# EasyEDA Pro project 4G-watch-pcb.epro

# Schematic Schematic1_1

## Sheets
1 MIC_SPK: Assembly Variant: Basic; Board Name: Board1; Create Date: 2026-01-22; Page Name: P5; Project Name: 手表; Schematic Name: Schematic1; Update Date: 2026-01-22; BladeWidth: 10; Company: 嘉立创EDA; Page Size: A4; RegionStart: 1; ShowBorder: 1; TitleBlock: 1; TitleBlockPosition: 3; Version: V1.0; XRegionCount: 6; YRegionCount: 4
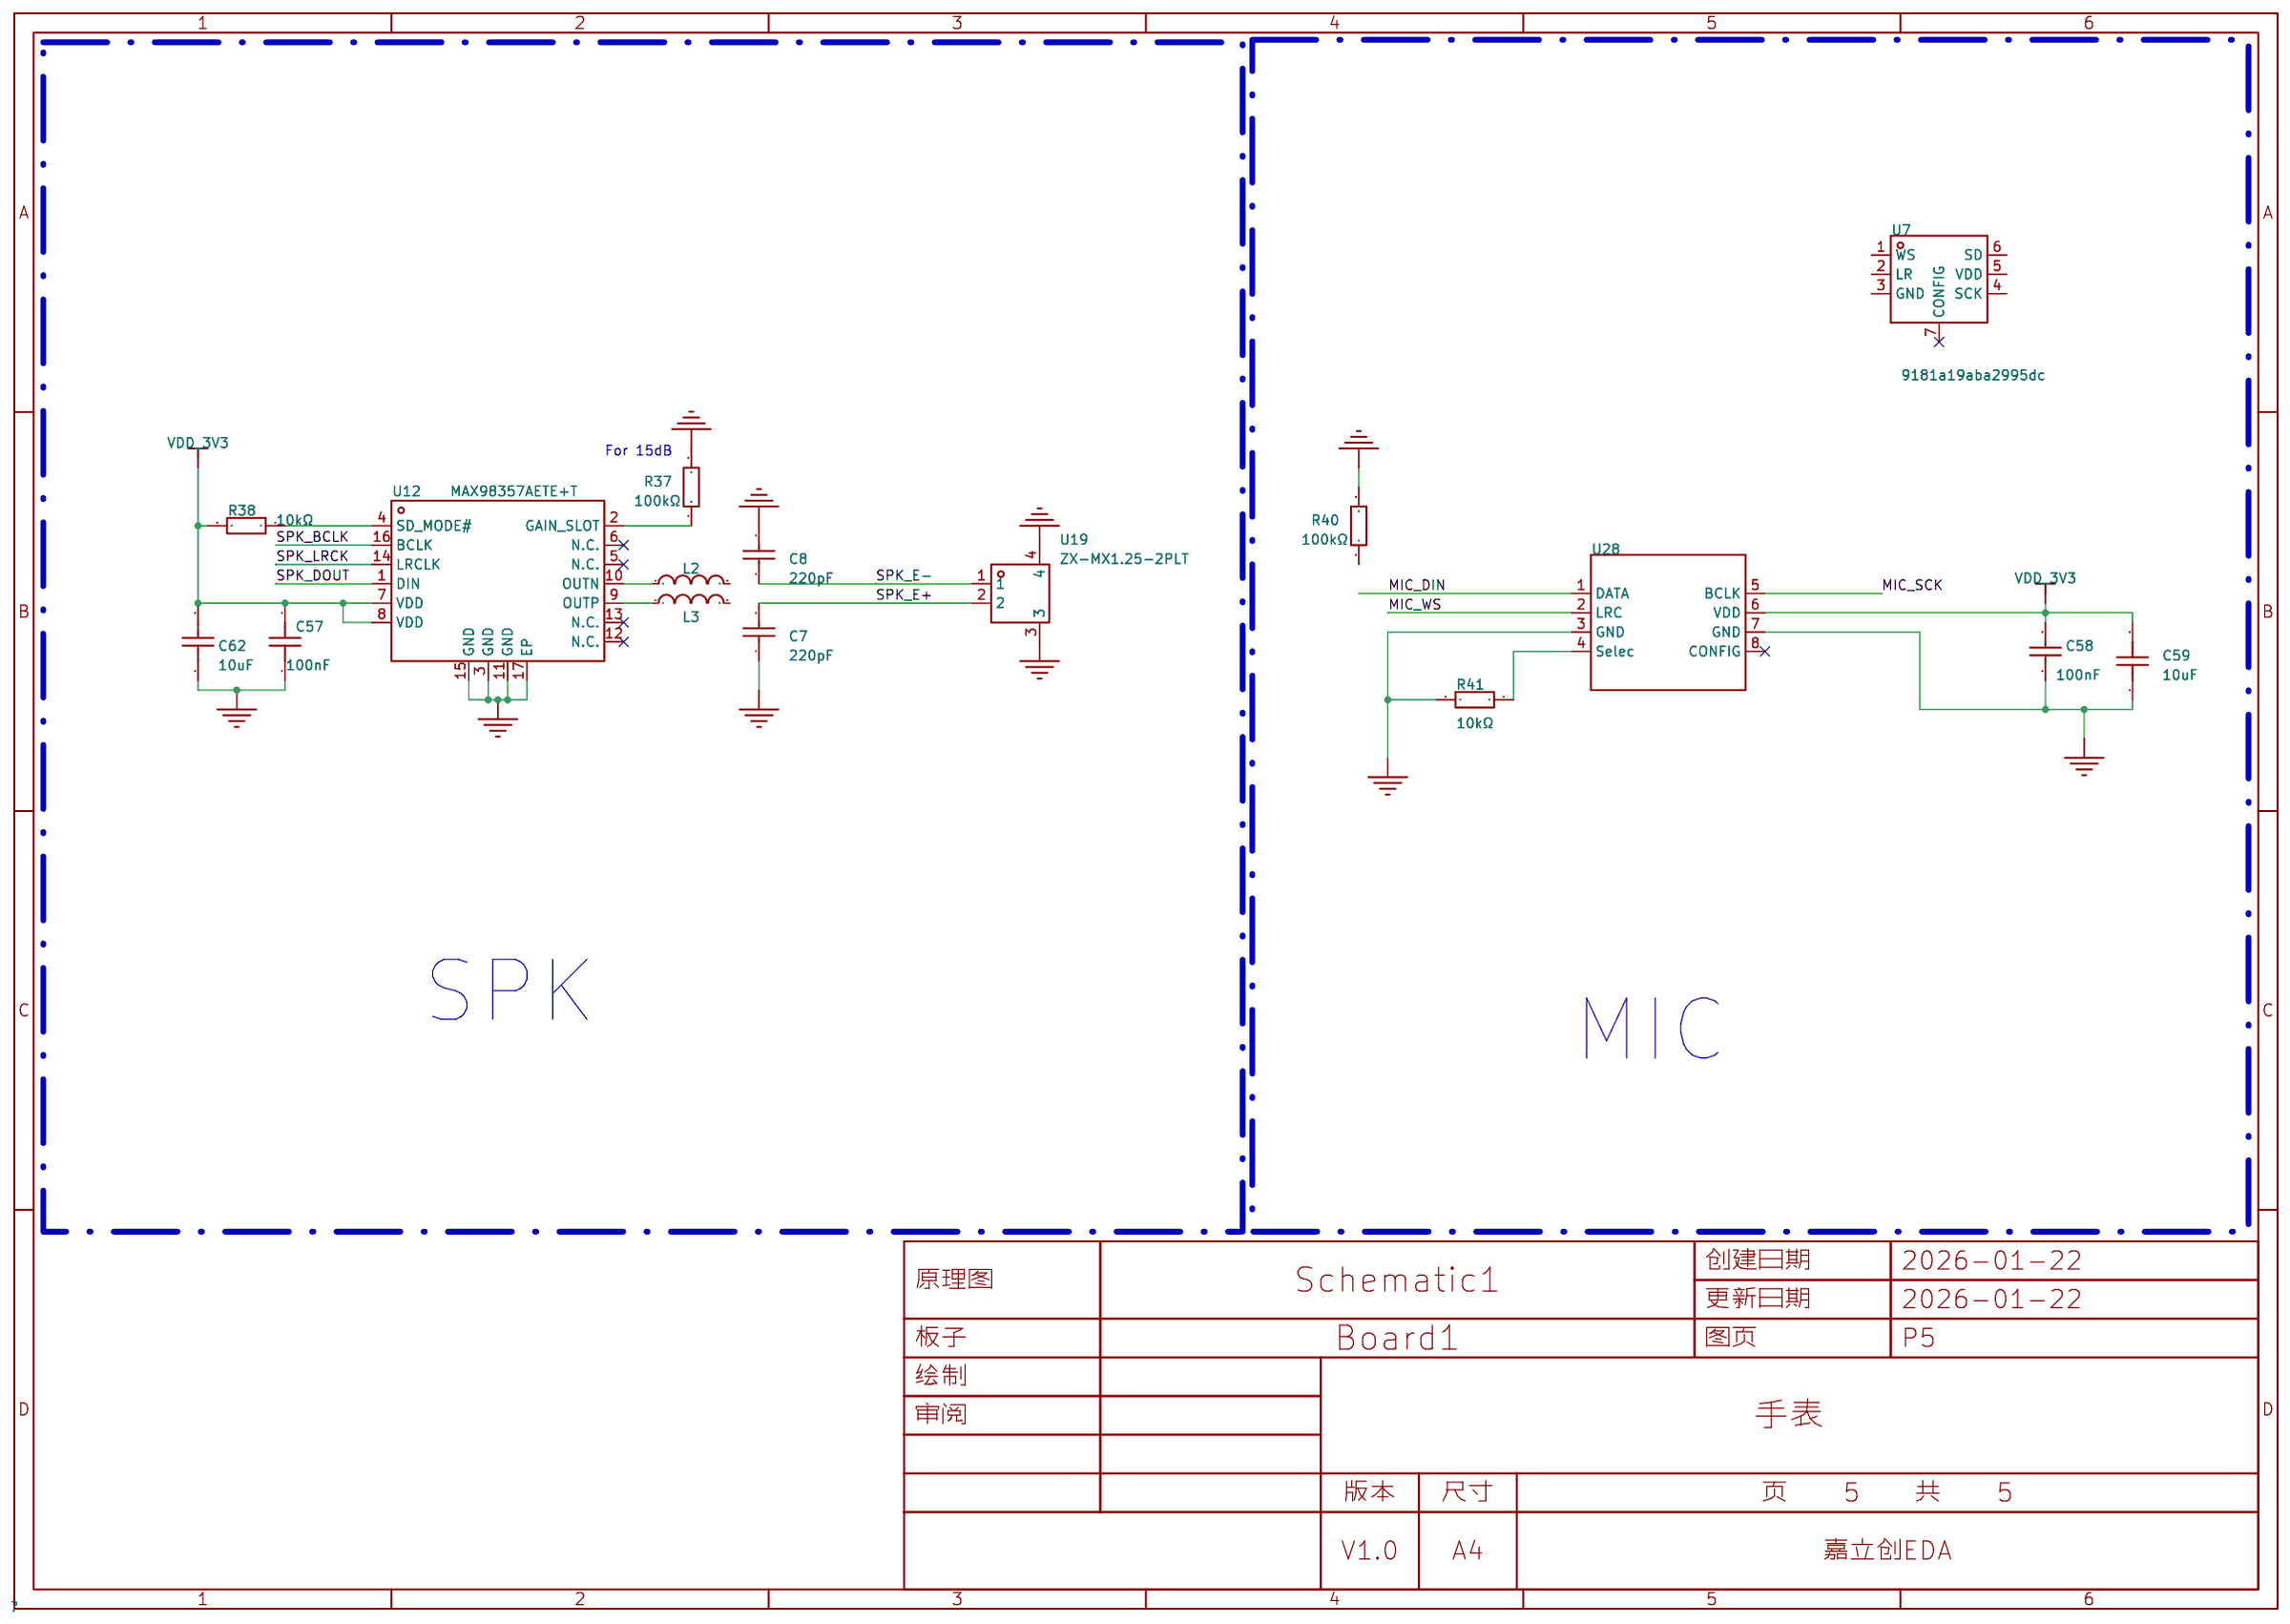
[diagram p0: MIC_SPK]
2 ESP32S3R8: Create Date: 2026-01-21; Page Name: P3; Update Date: 2026-01-21
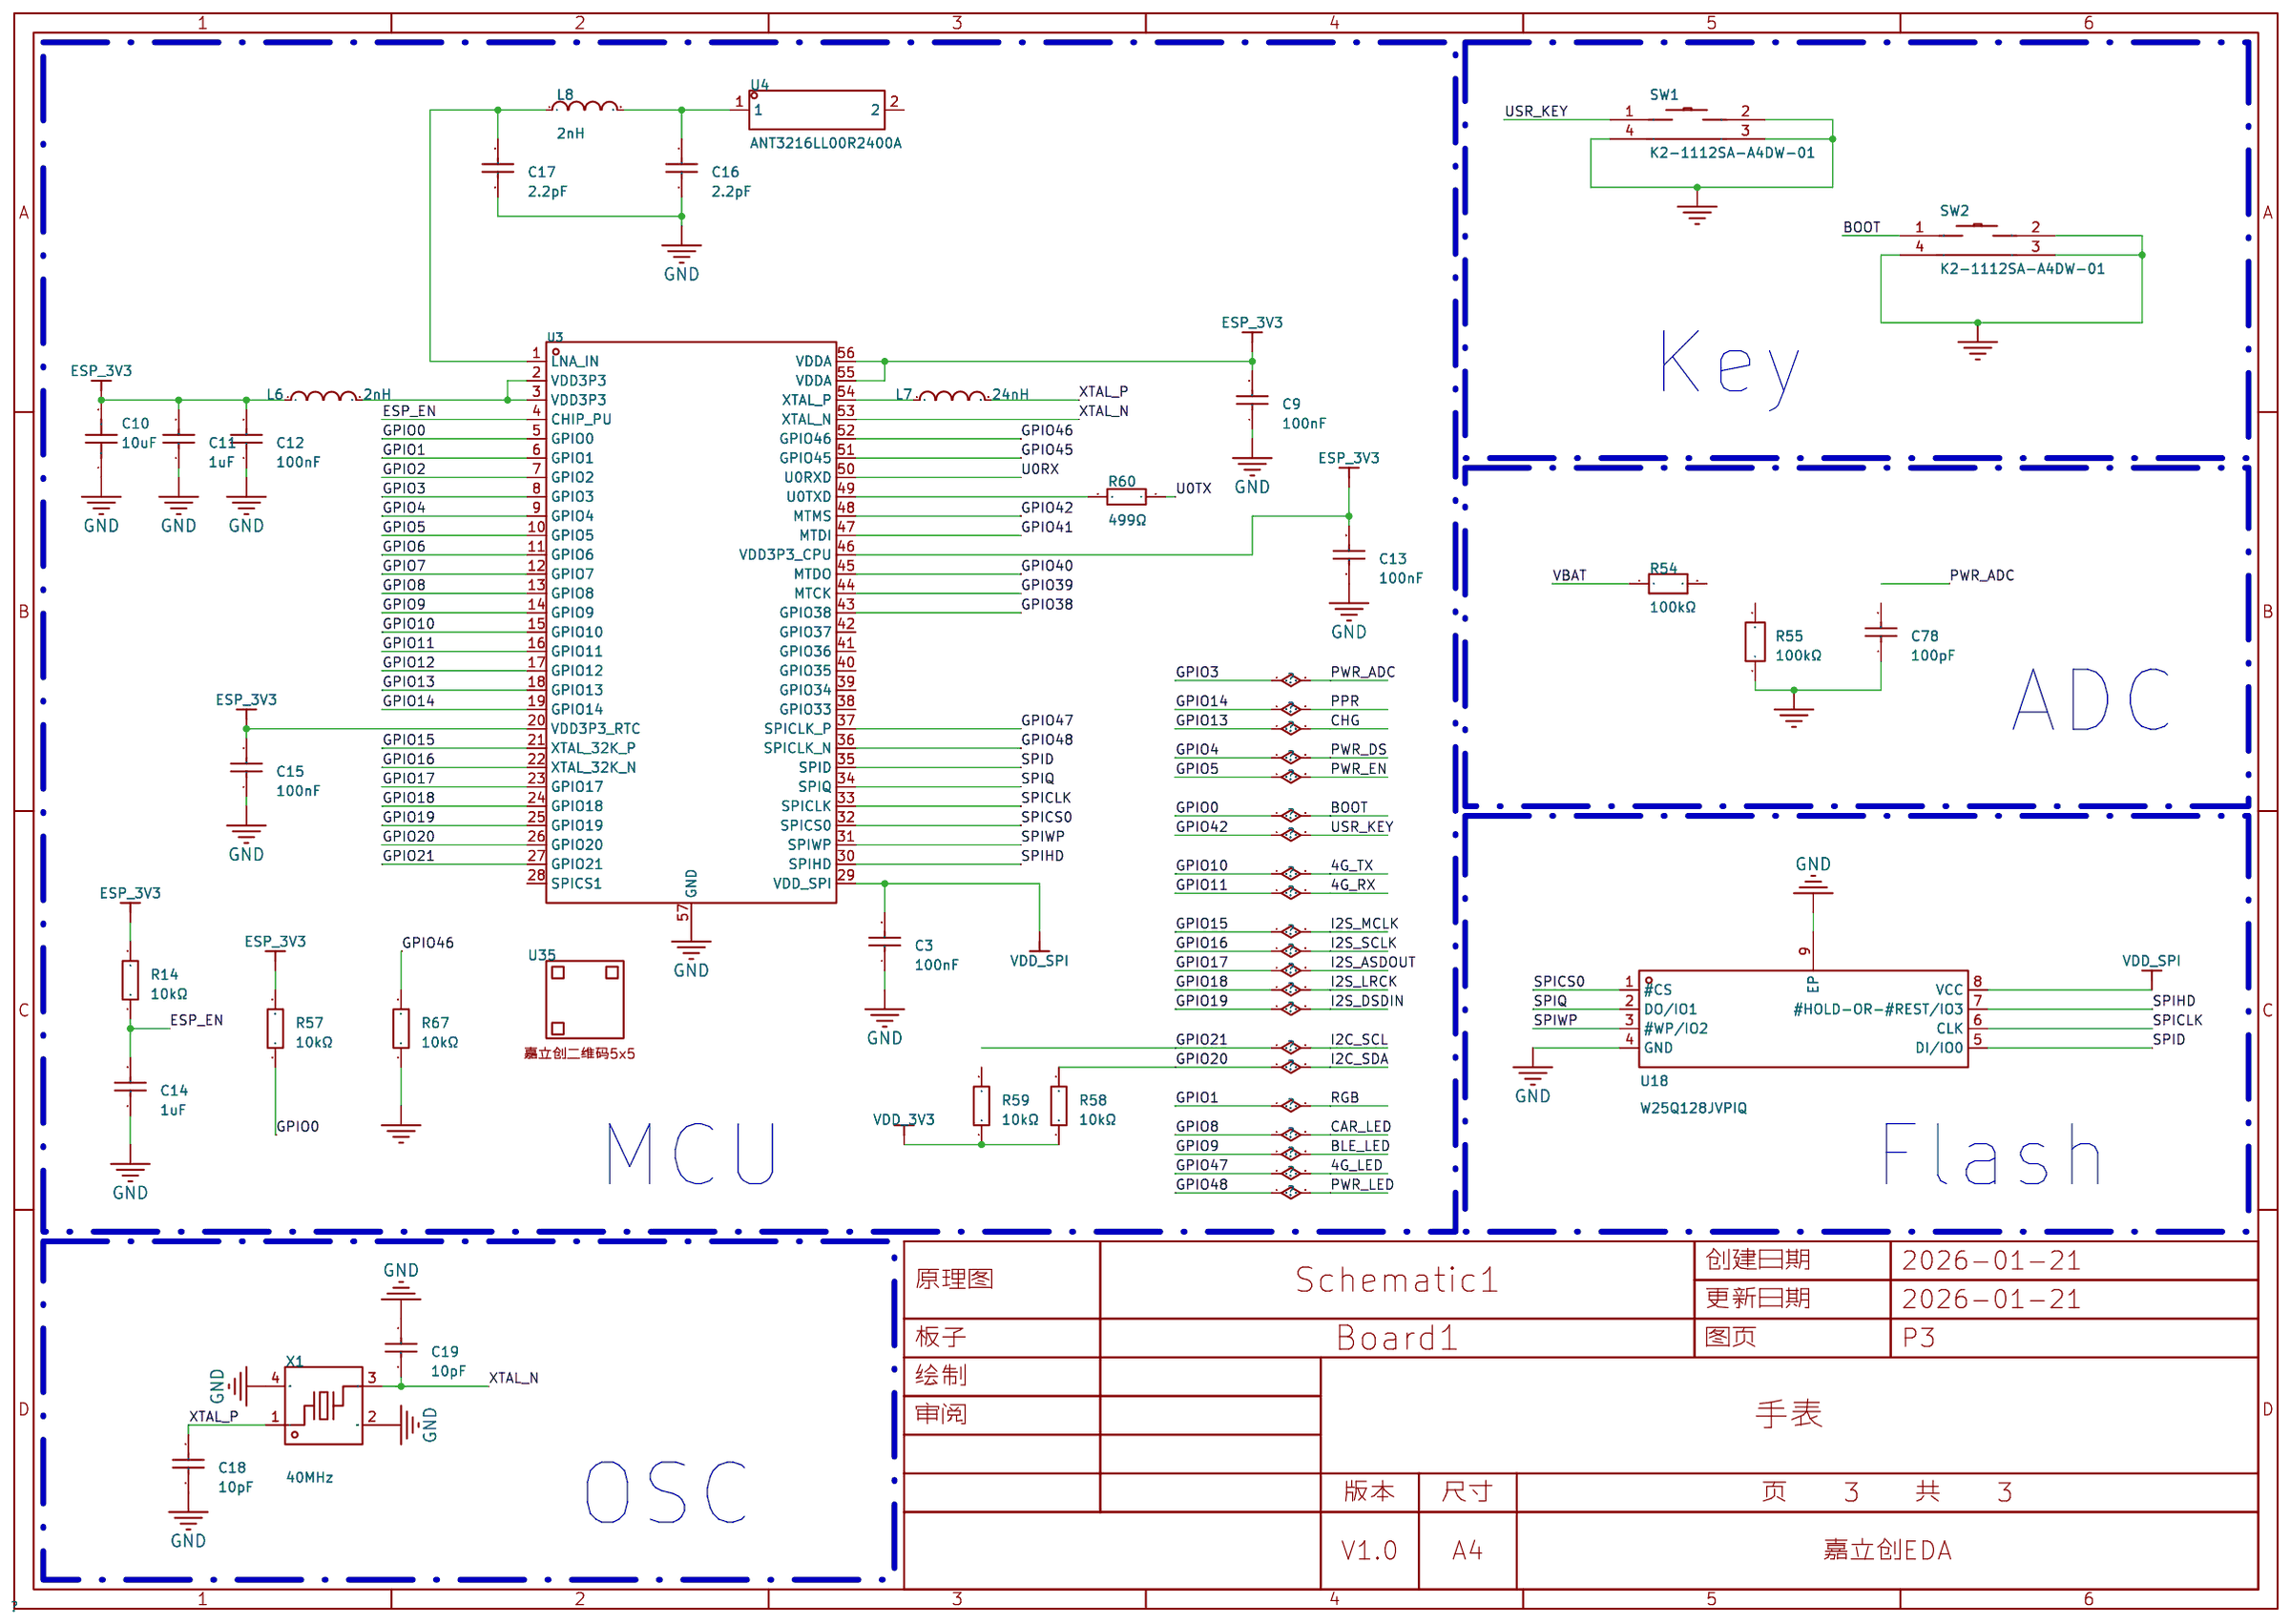
[diagram p1: ESP32S3R8]
3 ES8311: Create Date: 2026-01-21; Page Name: P2; Update Date: 2026-01-21
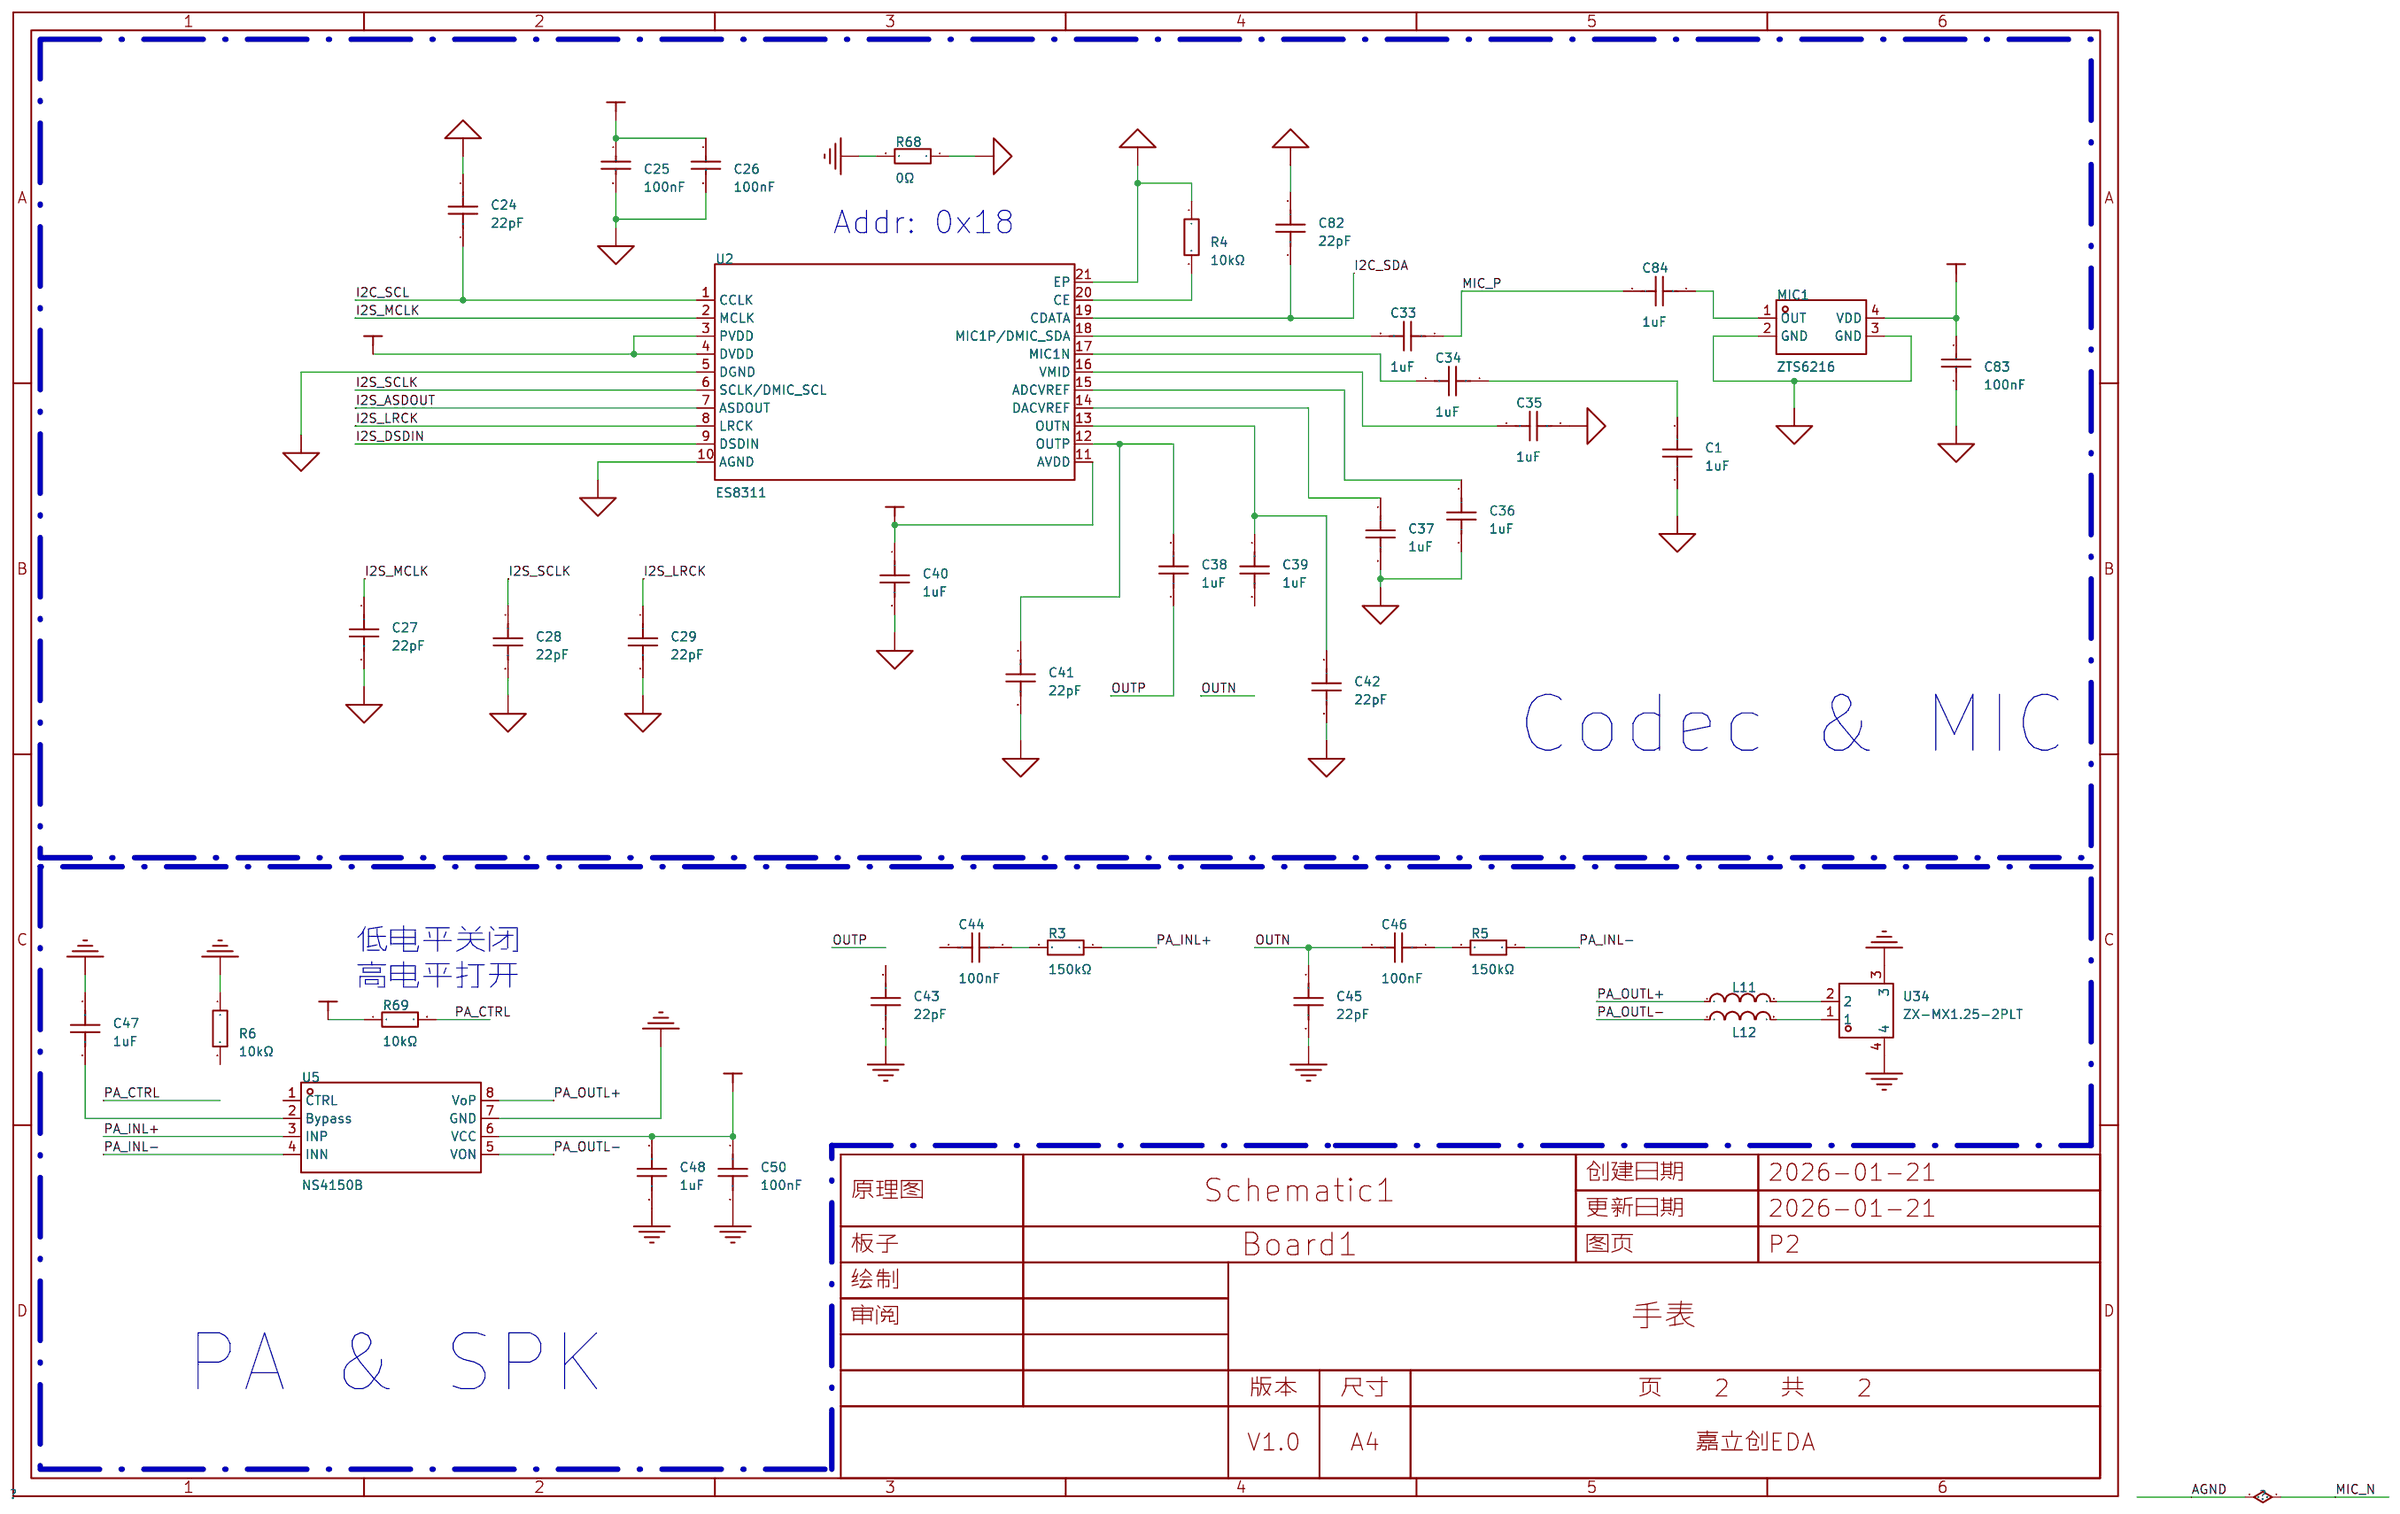
[diagram p2: ES8311]
4 LCD_RGB: Create Date: 2026-02-02; Page Name: P6; Update Date: 2026-02-02
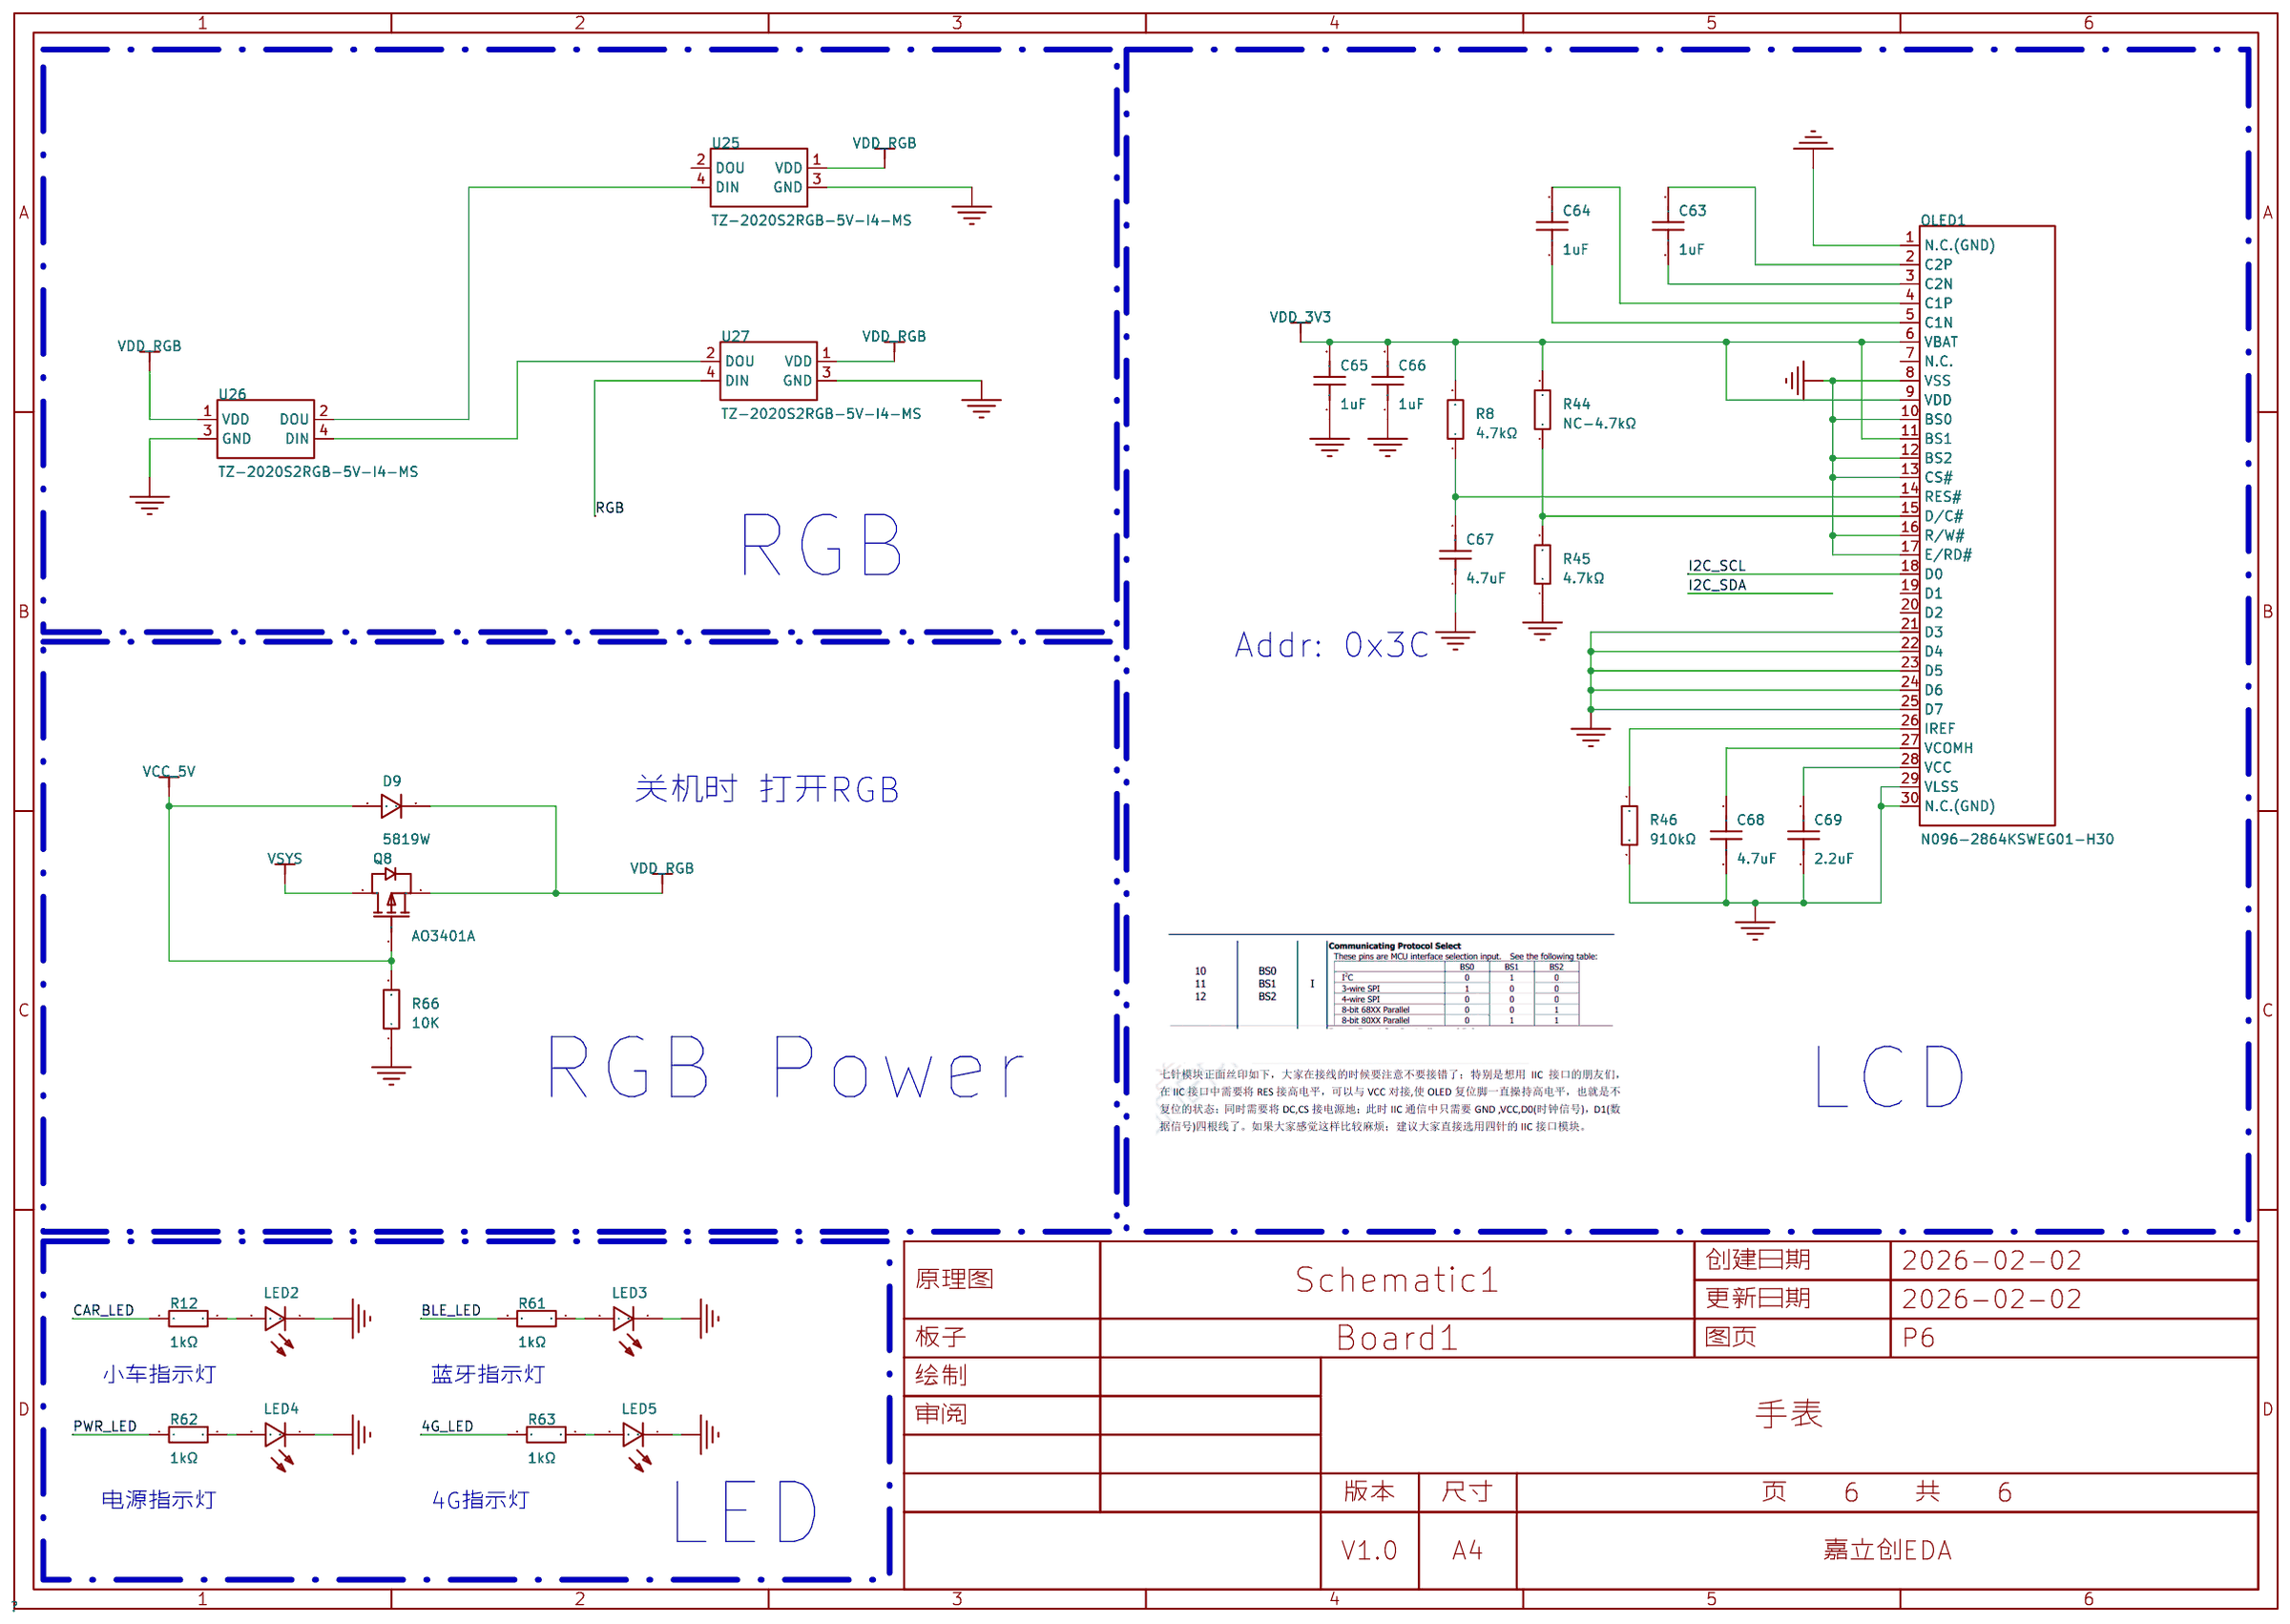
[diagram p3: LCD_RGB]
5 4G: Create Date: 2026-01-20; Page Name: P1; Update Date: 2026-01-20
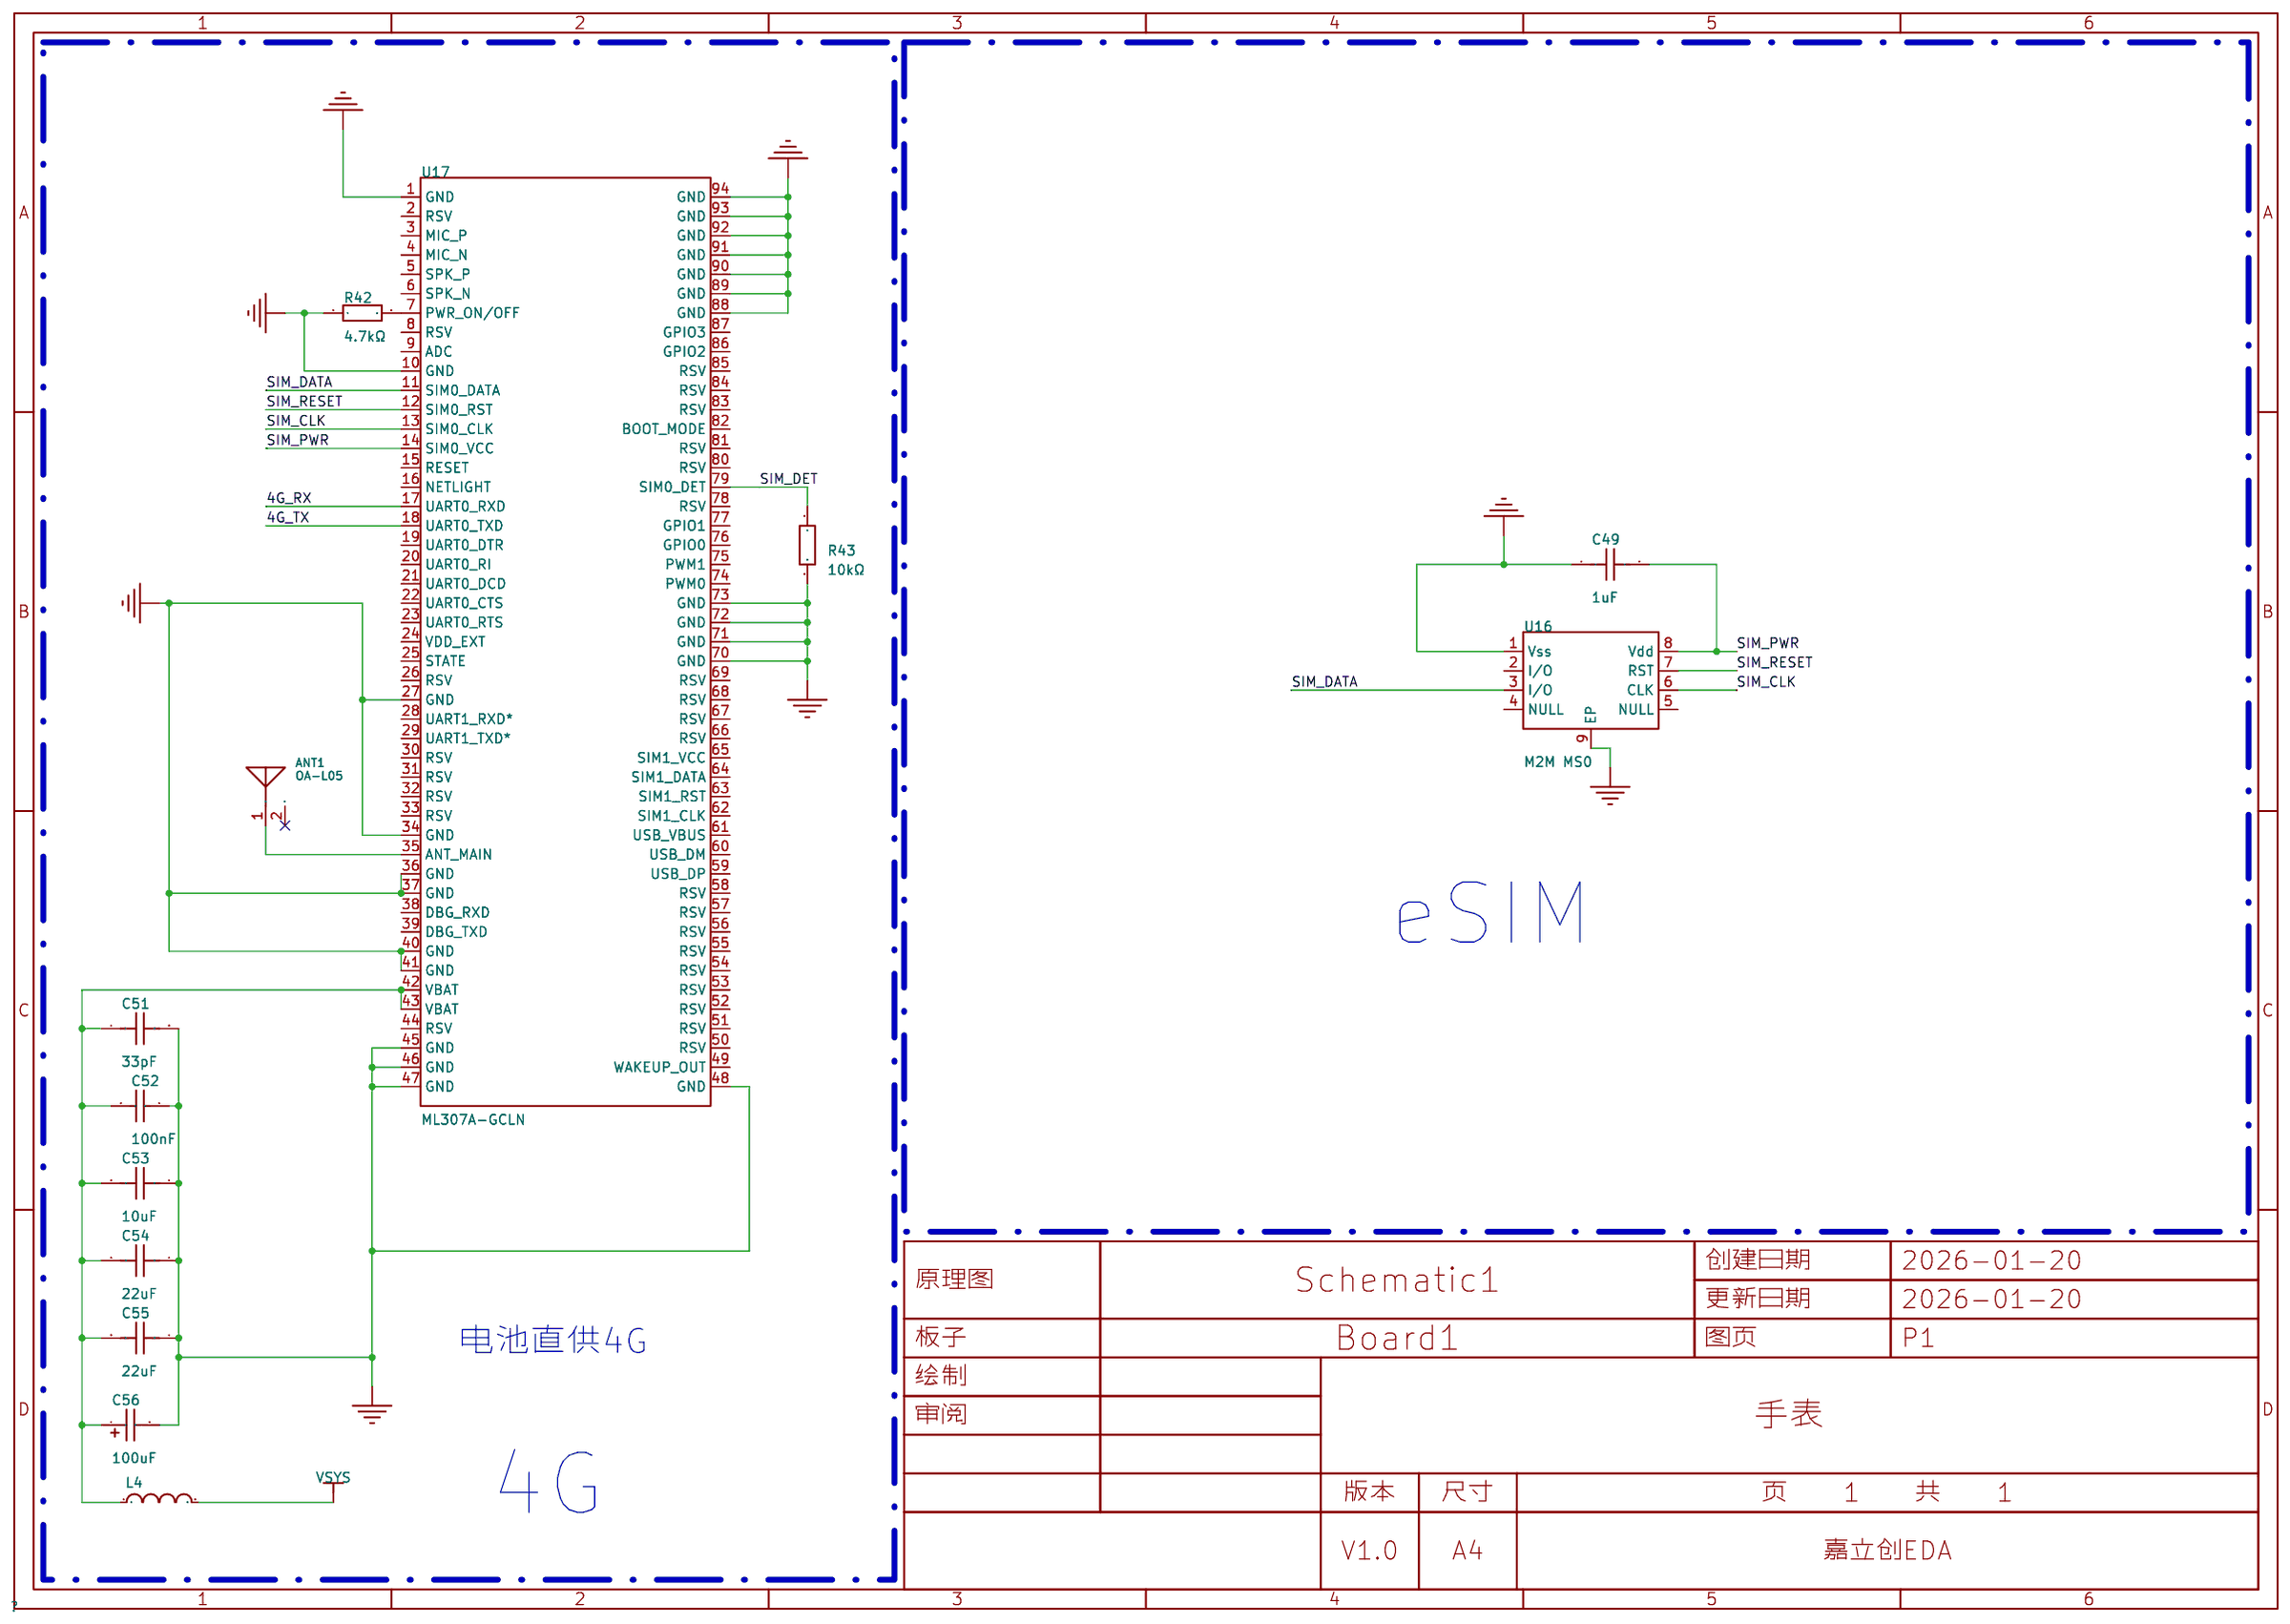
[diagram p4: 4G]
6 POWER: Create Date: 2026-01-21; Page Name: P4; Update Date: 2026-01-21
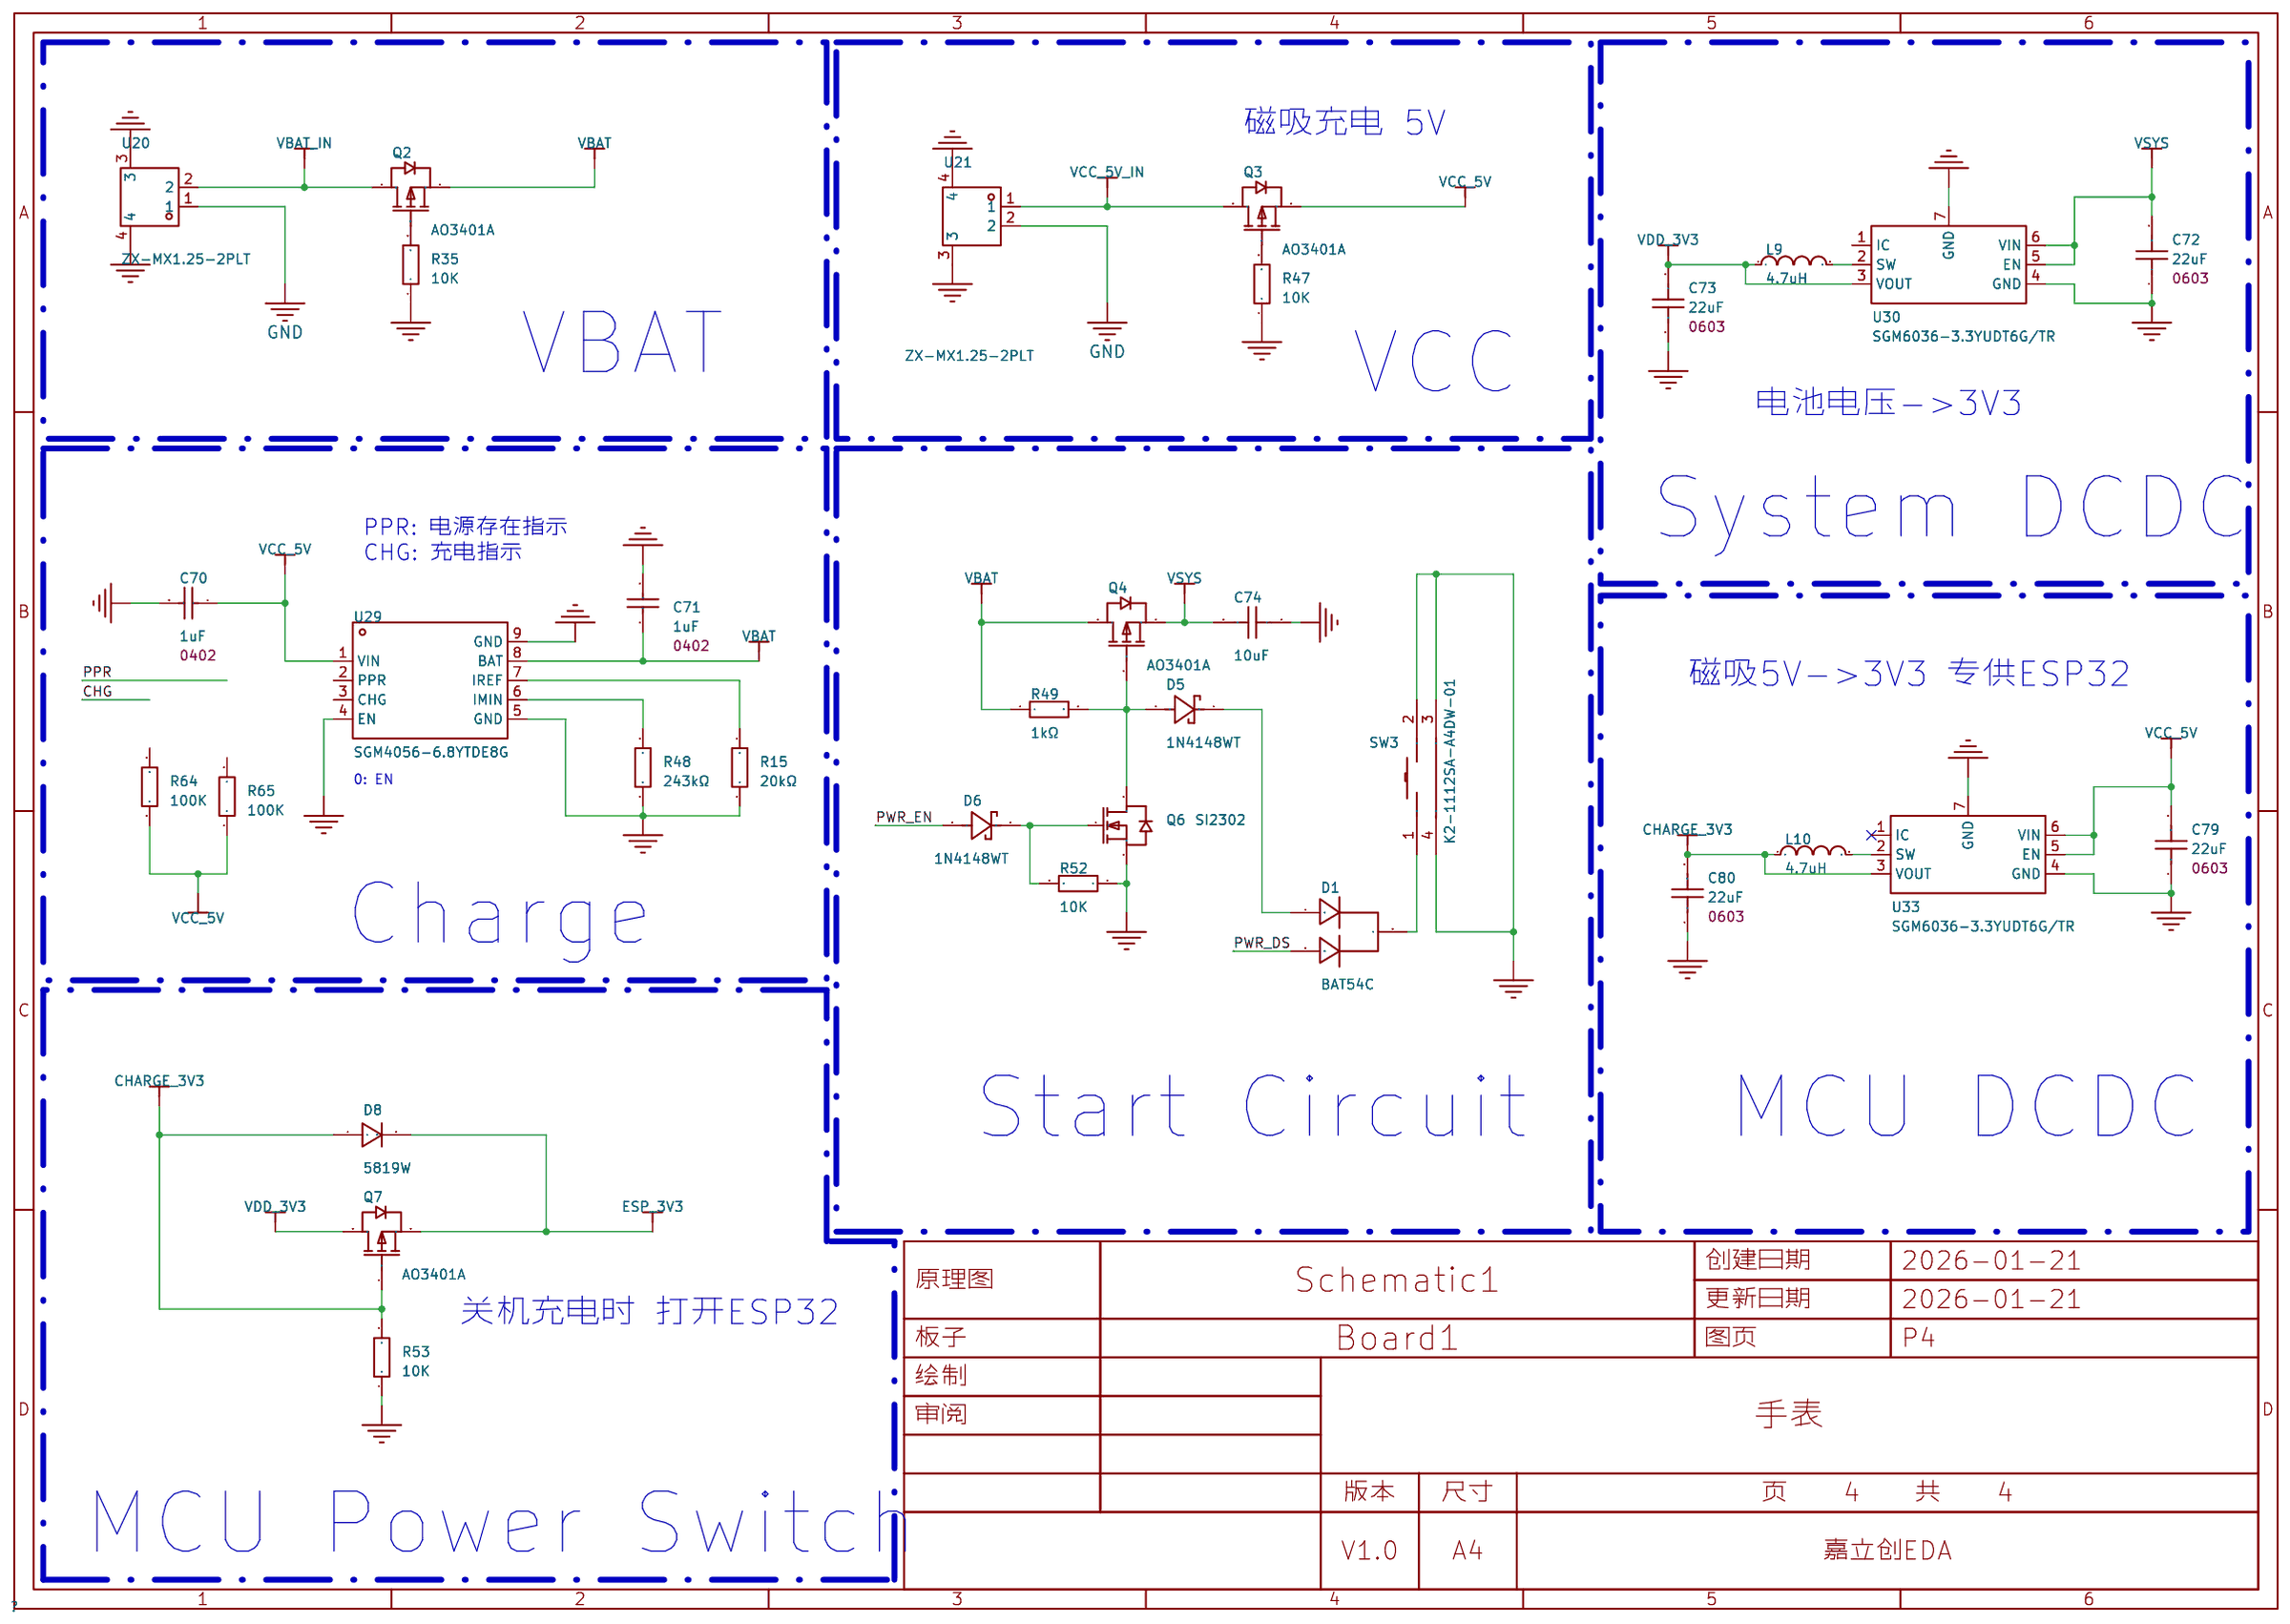
[diagram p5: POWER]
7 OVERVIEW: Create Date: 2026-02-03; Page Name: P3; Update Date: 2026-02-03
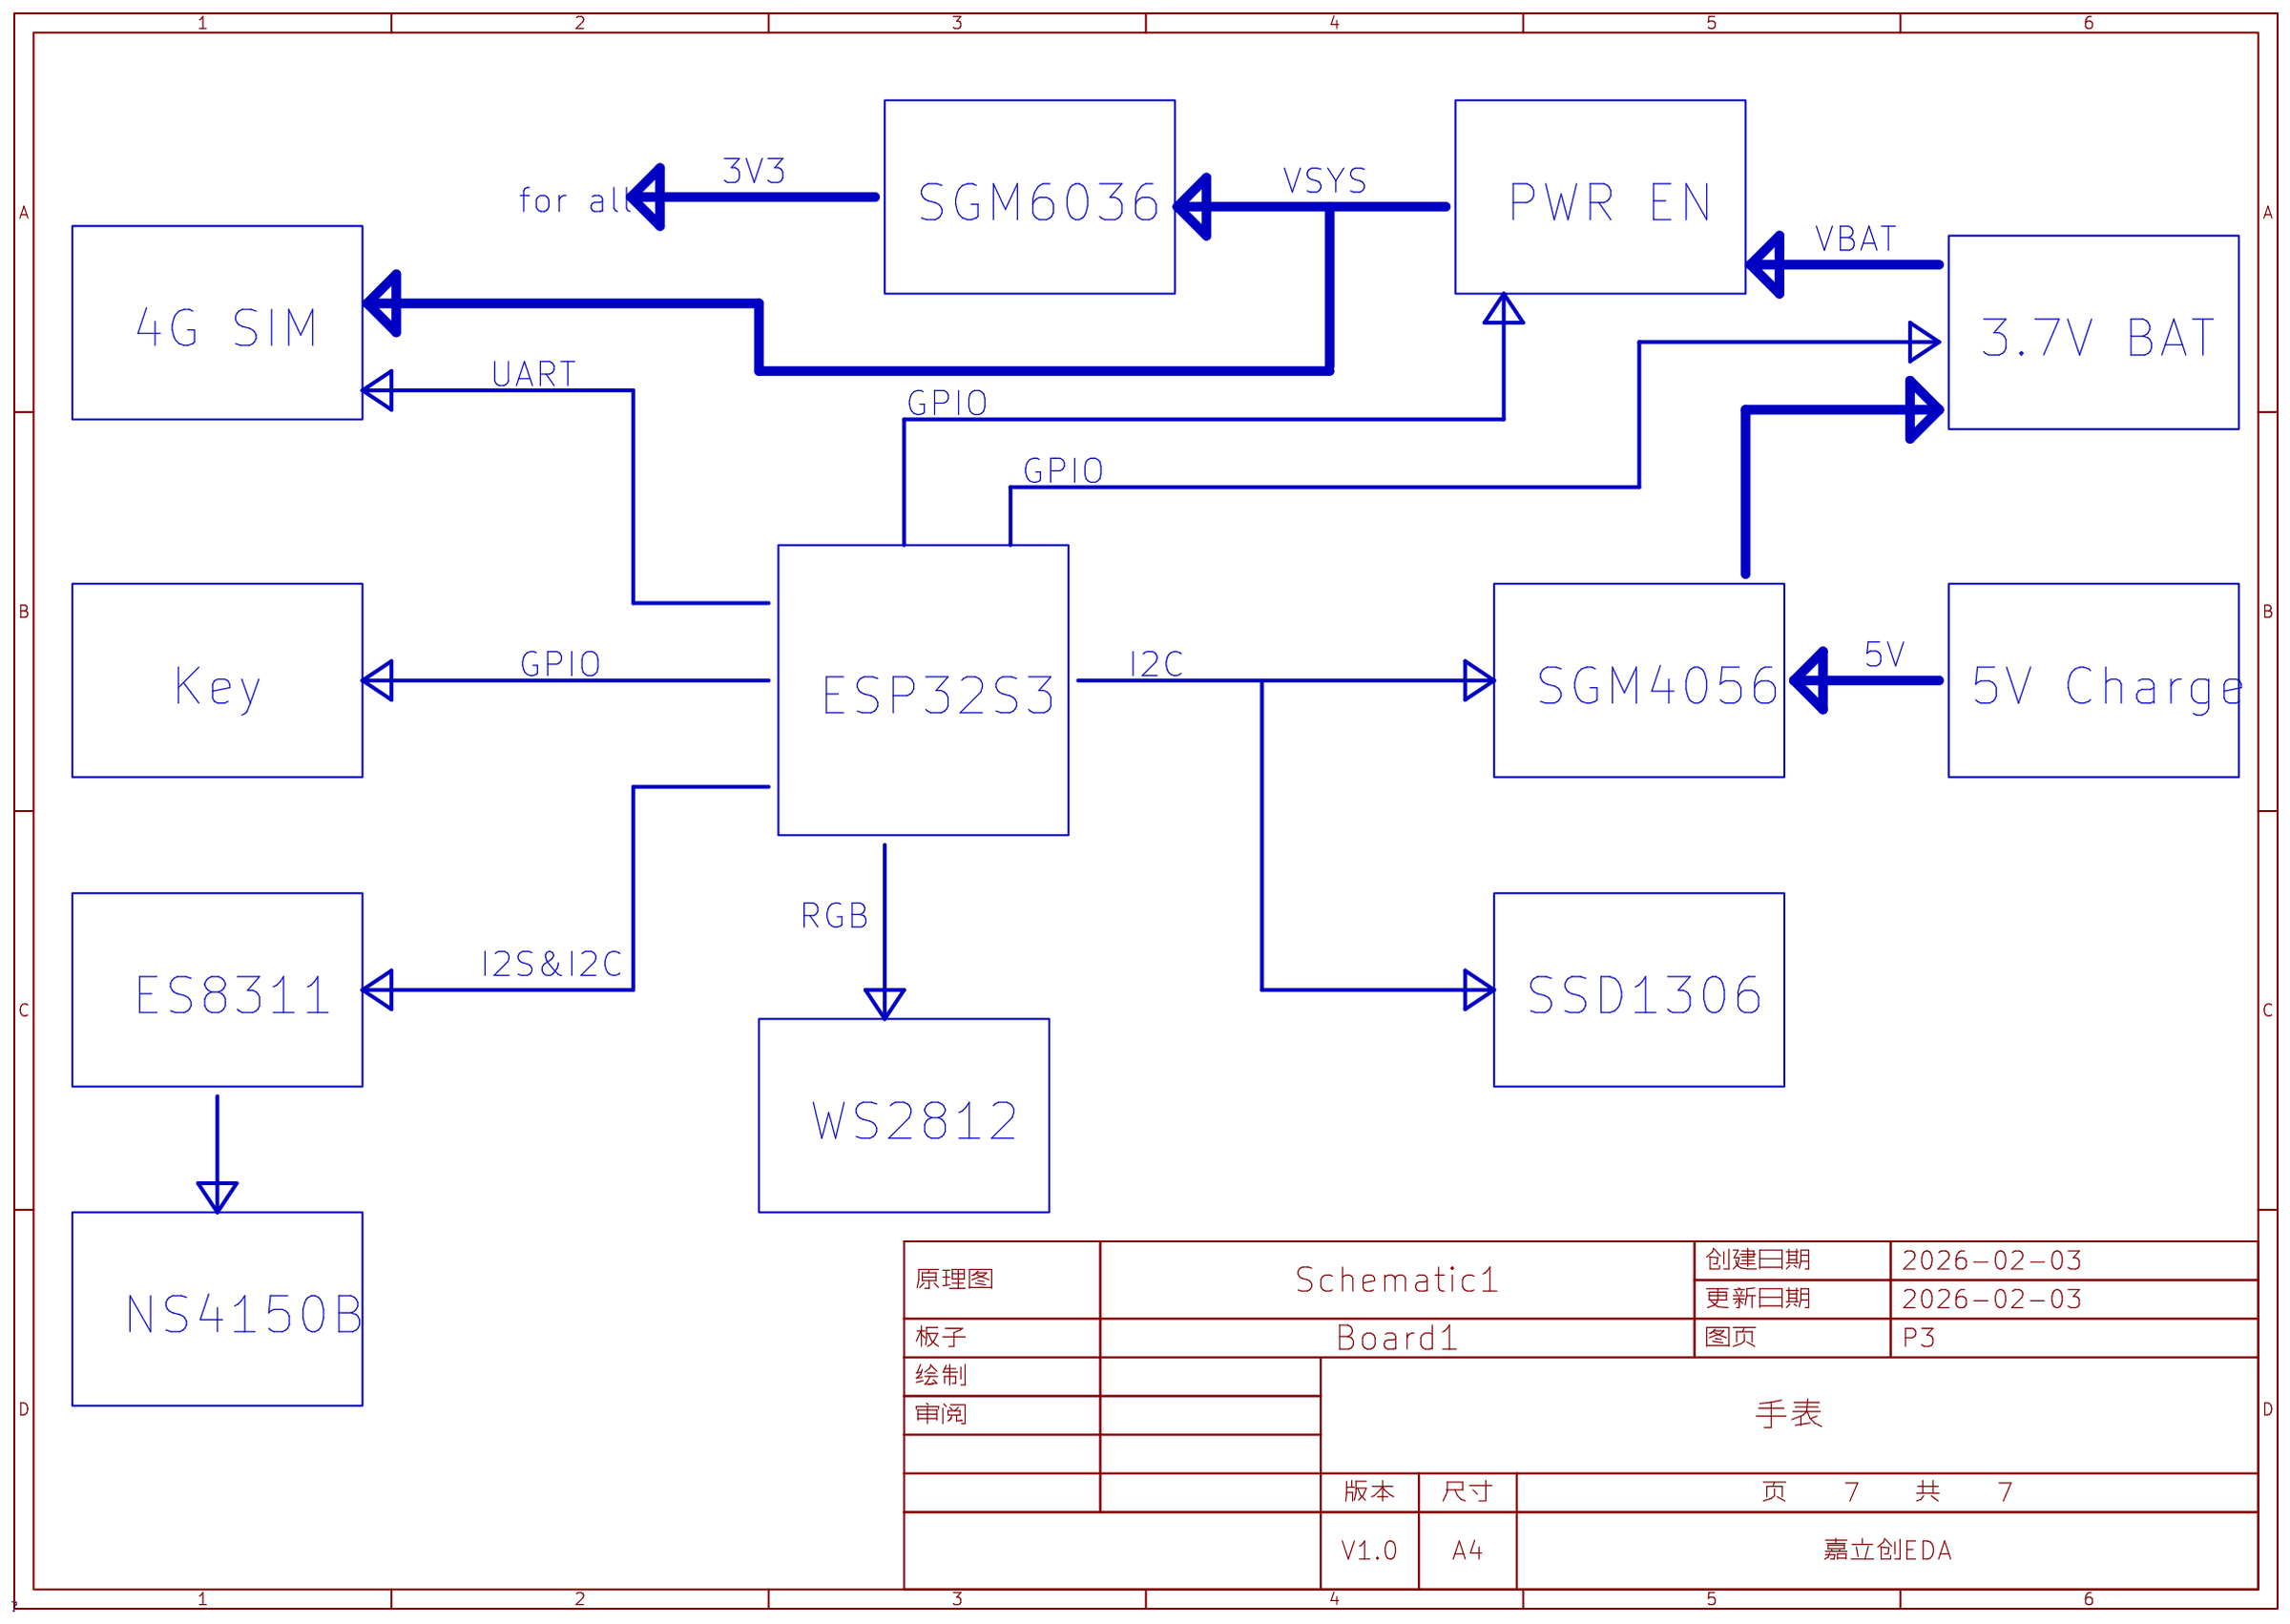
[diagram p6: OVERVIEW]

## Parts
sheet 4G
ANT1  OA-L05  [OA-L05]  (no BOM)
C49  1uF  [C0402]
C51  33pF  [C0402]
C52  100nF  [C0402_1]
C53  10uF  [C0603]
C54  22uF  [C0603]
C55  22uF  [C0603]
C56  100uF  [CASE-B_3528]
L4  BLM18PG121SN1D  [L0603]
R42  4.7kΩ  [R0402]
R43  10kΩ  [R0402]
U16  M2M MS0  [WSON-8_L6.0-W5.0-P1.27-TL-EP]
U17  ML307A-GCLN  [LCC-LGA-94_L17.7-W15.8-P1.10-TL]
sheet ES8311
C1  1uF  [C0402]
C24  22pF  [C0402]
C25  100nF  [C0402_1]
C26  100nF  [C0402_1]
C27  22pF  [C0402]
C28  22pF  [C0402]
C29  22pF  [C0402]
C33  1uF  [C0402]
C34  1uF  [C0402]
C35  1uF  [C0402]
C36  1uF  [C0402]
C37  1uF  [C0402]
C38  1uF  [C0402]
C39  1uF  [C0402]
C40  1uF  [C0402]
C41  22pF  [C0402]
C42  22pF  [C0402]
C43  22pF  [C0402]
C44  100nF  [C0402]
C45  22pF  [C0402]
C46  100nF  [C0402]
C47  1uF  [C0402]
C48  1uF  [C0402]
C50  100nF  [C0402]
C82  22pF  [C0402]
C83  100nF  [C0402_1]
C84  1uF  [C0402]
L11  GZ1608D601TF  [L0603_1]
L12  GZ1608D601TF  [L0603_1]
MIC1  ZTS6216  [MIC-SMD_4P-L2.8-W1.9-P1.84-TL]
R3  150kΩ  [R0402]
R4  10kΩ  [R0402]
R5  150kΩ  [R0402]
R6  10kΩ  [R0402]
R68  0Ω  [R0402]
R69  10kΩ  [R0402]
U2  ES8311  [WQFN-20_L3.0-W3.0-P0.40-BL-EP1.7]
U5  NS4150B  [MSOP-8_L3.0-W3.0-P0.65-LS5.0-BL]
U34  ZX-MX1.25-2PLT  [CONN-SMD_2P-P1.25-MX1.25-2P-LT]
sheet ESP32S3R8
C3  100nF  [C0402-NSK]
C9  100nF  [C0402-NSK]
C10  10uF  [C0603 NSK]
C11  1uF  [C0402-NSK]
C12  100nF  [C0402-NSK]
C13  100nF  [C0402-NSK]
C14  1uF  [C0402-NSK]
C15  100nF  [C0402-NSK]
C16  2.2pF  [C0402-NSK]
C17  2.2pF  [C0402-NSK]
C18  10pF  [C0402-NSK]
C19  10pF  [C0402-NSK]
C78  100pF  [C0402]
L6  2nH  [L0402-NSK]
L7  24nH  [L0402-NSK]
L8  2nH  [L0402-NSK]
R14  10kΩ  [R0402-NSK_2]
R54  100kΩ  [R0402]
R55  100kΩ  [R0402]
R57  10kΩ  [R0402-NSK_2]
R58  10kΩ  [R0402-NSK_2]
R59  10kΩ  [R0402-NSK_2]
R60  499Ω  [R0402-NSK_2]
R67  10kΩ  [R0402-NSK_2]
SW1  K2-1112SA-A4DW-01  [KEY-TH_K2-1112SA-AXXW-XX]
SW2  K2-1112SA-A4DW-01  [KEY-TH_K2-1112SA-AXXW-XX]
U3  ESP32-S3(R8)  [QFN-56_L7.0-W7.0-P0.40-TL-EP4.0]
U4  ANT3216LL00R2400A  [ANT-SMD_L3.2-W1.6]
U18  W25Q128JVPIQ  [WSON-8_L6.0-W5.0-P1.27-BL-EP]
U35  -  [JLC-QRCODE-5x5]
X1  40MHz  [CRYSTAL-SMD_4P-L2.5-W2.0-BL]
sheet LCD_RGB
C63  1uF  [C0402_3]
C64  1uF  [C0402_3]
C65  1uF  [C0402_3]
C66  1uF  [C0402_3]
C67  4.7uF  [C0402_3]
C68  4.7uF  [C0402_3]
C69  2.2uF  [C0402_3]
D9  5819W  [SOD-123_L2.7-W1.6-LS3.7-FD]
LED2  19-217/GHC-YR1S2/3T  [LED0603-RD]
LED3  19-217/GHC-YR1S2/3T  [LED0603-RD]
LED4  19-217/GHC-YR1S2/3T  [LED0603-RD]
LED5  19-217/GHC-YR1S2/3T  [LED0603-RD]
OLED1  N096-2864KSWEG01-H30  [OLED_0.96-30P-P0.70-12864]
Q8  AO3401A  [SOT-23_L2.9-W1.3-P1.90-LS2.4-BR]
R8  4.7kΩ  [R0402]
R12  1kΩ  [R0402_3]
R44  NC-4.7kΩ  [R0402]
R45  4.7kΩ  [R0402]
R46  910kΩ  [R0402]
R61  1kΩ  [R0402_3]
R62  1kΩ  [R0402_3]
R63  1kΩ  [R0402_3]
R66  10K  [R0402_4]
U25  TZ-2020S2RGB-5V-I4-MS  [LED-SMD_4P-L2.0-W2.0_FZ_2020]
U26  TZ-2020S2RGB-5V-I4-MS  [LED-SMD_4P-L2.0-W2.0_FZ_2020]
U27  TZ-2020S2RGB-5V-I4-MS  [LED-SMD_4P-L2.0-W2.0_FZ_2020]
sheet MIC_SPK
C7  220pF  [C0402]
C8  220pF  [C0402]
C57  100nF  [C0402]
C58  100nF  [C0402_1]
C59  10uF  [C0603]
C62  10uF  [C0603]
L2  GZ1608D601TF  [L0603_1]
L3  GZ1608D601TF  [L0603_1]
R37  100kΩ  [R0402_4]
R38  10kΩ  [R0402]
R40  100kΩ  [R0402_4]
R41  10kΩ  [R0402]
U7  9181a19aba2995dc  [MIC-SMD_7P-L3.5-W2.7-P0.90-BL_1]
U12  MAX98357AETE+T  [TQFN-16_L3.0-W3.0-P0.50-BL-EP1.5]
U19  ZX-MX1.25-2PLT  [CONN-SMD_2P-P1.25-MX1.25-2P-LT]
U28  -  [my_zts6631]
sheet POWER
C70  1uF  [R0402_1]
C71  1uF  [R0402_1]
C72  22uF  [R0603]
C73  22uF  [R0603]
C74  10uF  [C0603]
C79  22uF  [R0603]
C80  22uF  [R0603]
D1  BAT54C  [SOT-23-3_L2.9-W1.3-P1.90-LS2.4-BR]
D5  1N4148WT  [SOD-523_L1.2-W0.8-LS1.6-RD]
D6  1N4148WT  [SOD-523_L1.2-W0.8-LS1.6-RD]
D8  5819W  [SOD-123_L2.7-W1.6-LS3.7-FD]
L9  4.7uH  [IND-SMD_L2.5-W2.0]
L10  4.7uH  [IND-SMD_L2.5-W2.0]
Q2  AO3401A  [SOT-23_L2.9-W1.3-P1.90-LS2.4-BR]
Q3  AO3401A  [SOT-23_L2.9-W1.3-P1.90-LS2.4-BR]
Q4  AO3401A  [SOT-23_L2.9-W1.3-P1.90-LS2.4-BR]
Q6  SI2302  [SOT-23-3_L2.9-W1.3-P1.90-LS2.4-BR]
Q7  AO3401A  [SOT-23_L2.9-W1.3-P1.90-LS2.4-BR]
R15  20kΩ  [R0402_3]
R35  10K  [R0402_4]
R47  10K  [R0402_4]
R48  243kΩ  [R0402_3]
R49  1kΩ  [R0402_3]
R52  10K  [R0402_4]
R53  10K  [R0402_4]
R64  100K  [R0402_4]
R65  100K  [R0402_4]
SW3  K2-1112SA-A4DW-01  [KEY-TH_K2-1112SA-AXXW-XX]
U20  ZX-MX1.25-2PLT  [CONN-SMD_2P-P1.25-MX1.25-2P-LT]
U21  ZX-MX1.25-2PLT  [CONN-SMD_2P-P1.25-MX1.25-2P-LT]
U29  SGM4056-6.8YTDE8G  [TDFN-8L_L2.0-W2.0-P0.50-BL-EP]
U30  SGM6036-3.3YUDT6G/TR  [UTDFN-6_L2.0-W1.5-P0.50-BL-EP]
U33  SGM6036-3.3YUDT6G/TR  [UTDFN-6_L2.0-W1.5-P0.50-BL-EP]

## Library data of the parts
ANT1 = OA-L05
C49 = CL05A105KA5NQNC: 容值:1uF;精度:±10%;额定电压:25V;温度系数:X5R;; LCSC Part Name: 1uF ±10% 25V; Supplier Part: C52923; Manufacturer: SAMSUNG(三星); Supplier Footprint: 0402; JLCPCB Part Class: Basic Part; Datasheet: https://item.szlcsc.com/datasheet/CL05A105KA5NQNC/53938.html; Supplier: LCSC; Tolerance: ±10%; Voltage Rating: 25V; Temperature Coefficient: X5R
C1 C24 C27-C29 C33-C48 C50 C51 C82 C84 = FCC0402N330J500AT: 容值:33pF;精度:±5%;额定电压:50V;温度系数:C0G;; LCSC Part Name: 33pF ±5% 50V; Supplier Part: C5137486; Manufacturer: FOJAN(富捷); Supplier Footprint: 0402; JLCPCB Part Class: Extended Part; Datasheet: https://atta.szlcsc.com/upload/public/pdf/source/20220818/0EB3B7FB2F5648AC16609637FBA7DABE.pdf; Supplier: LCSC; Tolerance: ±5%; Voltage Rating: 50V; Temperature Coefficient: C0G
C25 C26 C52 C58 C83 = CL05B104KO5NNNC: 容值:100nF;精度:±10%;额定电压:16V;材质(温度系数):X7R;; LCSC Part Name: 100nF ±10% 16V; Supplier Part: C1525; Manufacturer: SAMSUNG(三星); Supplier Footprint: 0402; Datasheet: https://atta.szlcsc.com/upload/public/pdf/source/20160218/1457707763339.pdf; Supplier: LCSC; Tolerance: ±10%; Voltage Rated: 16V; Temperature Coefficient: X7R; Check: true
C53 C59 C74 = CL10A106KP8NNNC: 容值:10uF;精度:±10%;额定电压:10V;温度系数:X5R;; LCSC Part Name: 10uF ±10% 10V; Supplier Part: C19702; Manufacturer: SAMSUNG(三星); Supplier Footprint: 0603; JLCPCB Part Class: Basic Part; Datasheet: https://item.szlcsc.com/datasheet/CL10A106KP8NNNC/20411.html; Supplier: LCSC; Tolerance: ±10%; Voltage Rating: 10V; Temperature Coefficient: X5R
C54 C55 = CL10A226MP8NUNE: 容值:22uF;精度:±20%;额定电压:10V;温度系数:X5R;; LCSC Part Name: 22uF ±20% 10V; Supplier Part: C86295; Manufacturer: SAMSUNG(三星); Supplier Footprint: 0603; JLCPCB Part Class: Extended Part; Datasheet: https://item.szlcsc.com/datasheet/CL10A226MP8NUNE/87471.html; Supplier: LCSC; Tolerance: ±20%; Voltage Rating: 10V; Temperature Coefficient: X5R
C56 = TAJB107K006RNJ: 容值:100uF;精度:±10%;额定电压:6.3V;等效串联电阻(ESR):1.7Ω@100kHz;; LCSC Part Name: 100uF ±10% 6.3V; Supplier Part: C16133; Manufacturer: Kyocera AVX; Supplier Footprint: CASE-B-3528-21(mm); JLCPCB Part Class: Basic Part; Supplier: LCSC; Tolerance: ±10%; Voltage Rating: 6.3V; Equivalent Series Resistance(ESR): 1.7Ω@100kHz; Operating Temperature: -55℃~+125℃
L4 = BLM18PG121SN1D: 阻抗@频率:120Ω@100MHz;误差:±25%;直流电阻(DCR):50mΩ;; LCSC Part Name: 单路 0603磁珠 阻抗120Ω@100MHz; Supplier Part: C14709; Manufacturer: muRata(村田); Supplier Footprint: 0603; JLCPCB Part Class: Basic Part; Datasheet: https://item.szlcsc.com/datasheet/BLM18PG121SN1D/15379.html; Supplier: LCSC; Impedance @ Frequency: 120Ω@100MHz; Tolerance: ±25%; DC Resistance(DCR): 50mΩ; Current Rating: 2A; Number of Circuits: 1; Operating Temperature: -55℃~+125℃
R8 R42 R44-R46 = 0402WGF4701TCE: 电阻类型:厚膜电阻;阻值:4.7kΩ;精度:±1%;功率:62.5mW;工作电压:50V;温度系数:±100ppm/℃;; LCSC Part Name: 4.7kΩ ±1% 62.5mW 厚膜电阻; Supplier Part: C25900; Manufacturer: UNI-ROYAL(厚声); Supplier Footprint: 0402; JLCPCB Part Class: Basic Part; Datasheet: https://item.szlcsc.com/datasheet/0402WGF4701TCE/26643.html; Supplier: LCSC; Type: 厚膜电阻; Tolerance: ±1%; Power(Watts): 62.5mW; Voltage-Supply(Max): 50V; Temperature Coefficient: ±100ppm/℃; Operating Temperature: -55℃~+155℃
R3-R6 R38 R41 R43 R68 R69 = 0402WGF1002TCE: 电阻类型:厚膜电阻;阻值:10kΩ;精度:±1%;功率:62.5mW;最大工作电压:50V;温度系数:±100ppm/℃;; LCSC Part Name: 10kΩ ±1% 62.5mW 厚膜电阻; Supplier Part: C25744; Manufacturer: UNI-ROYAL(厚声); Supplier Footprint: 0402; JLCPCB Part Class: 基础库; Datasheet: https://atta.szlcsc.com/upload/public/pdf/source/20200306/C422600_1E6D84923E4A46A82E41ADD87F860B5C.pdf; Supplier: LCSC; Type: 厚膜电阻; Tolerance: ±1%; Power(Watts): 62.5mW; Overload Voltage (Max): 50V; Temperature Coefficient: ±100ppm/℃; Operating Temperature Range: -55℃~+155℃; Check: true
U16 = M2M MS0: Supplier Part: C9900094973; Supplier Footprint: QFN5*6-8; JLCPCB Part Class: Extended Part; Supplier: LCSC
U17 = ML307A-GCLN: 通信制式:TDD-LTE；FDD-LTE;接口类型:I2C；UART；SPI；USB；ADC;; LCSC Part Name: LTE Cat.1和NB-IoT模组; Supplier Part: C48982535; Manufacturer: Chinamobile(中移物联网); Supplier Footprint: SMD; JLCPCB Part Class: Extended Part; Datasheet: https://item.szlcsc.com/datasheet/ML307A-GCLN/51313684.html; Supplier: LCSC; Communication System: TDD-LTE；FDD-LTE; Interface: I2C；UART；SPI；USB；ADC; Voltage - Supply: 3.4V~4.5V; Current Consumption: 31uA
L2 L3 L11 L12 = GZ1608D601TF: 阻抗 @ 频率:600Ω@100MHz;误差:±25%;直流电阻(DCR):450mΩ;; LCSC Part Name: 单路 0603磁珠 阻抗600Ω@100MHz; Supplier Part: C1002; Manufacturer: Sunlord(顺络); Supplier Footprint: 0603; JLCPCB Part Class: 基础库; Datasheet: https://atta.szlcsc.com/upload/public/pdf/source/20241120/893429B990C3BA07384E734821D2F218.pdf; Supplier: LCSC; Impedance @ Frequency: 600Ω@100MHz; Tolerance: ±25%; DC Resistance: 450mΩ; Current Rating: 200mA; Circuits: 1
MIC1 = ZTS6216: 指向性:全指向;信噪比:65dB;灵敏度:-38dB;阻抗:100Ω;; LCSC Part Name: 1.5V~3.6V38dB; Supplier Part: C481302; Manufacturer: ZILLTEK(钰太); Supplier Footprint: SMD-4P,2.8x1.9mm; JLCPCB Part Class: Extended Part; Datasheet: https://item.szlcsc.com/datasheet/ZTS6216/488750.html; Supplier: LCSC; Direction: 全指向; Voltage - Supply: 1.5V~3.6V; Current Consumption: 120uA; S/N Ratio: 65dB; Sensitivity: -38dB; Impedance: 100Ω; Output Type: 模拟输出; Length: 2.75mm; Width: 1.85mm; Height: 1mm
U2 = ES8311: Supplier Part: C962342; Manufacturer: Everest-semi(顺芯); Supplier Footprint: QFN-20-EP(3x3); JLCPCB Part Class: Extended Part; Datasheet: https://item.szlcsc.com/datasheet/ES8311/1044199.html; Supplier: LCSC
U5 = NS4150B_C189961: 功放类型:D类功放;输出功率:3Wx1@4Ω;; Supplier Part: C189961; Manufacturer: Nsiway(纳芯威); Supplier Footprint: MSOP-8; JLCPCB Part Class: Extended Part; Datasheet: https://item.szlcsc.com/datasheet/NS4150B/207582.html; Supplier: LCSC; Class: D类功放; Output Power: 3Wx1@4Ω; Voltage - Supply: 3V~5.25V
U19-U21 U34 = ZX-MX1.25-2PLT: 插针结构:1x2P;间距:1.25mm;安装方式:立贴;参考系列:PicoBlade(MX 1.25);总PIN数:2P;排数:1;每排PIN数:2;行距:-;额定电流:1A;触头材质:黄铜;触头镀层:锡;工作温度:-25℃~+85℃;; LCSC Part Name: 1x2P 间距:1.25mm 立贴 系列:PicoBlade(MX 1.25); Supplier Part: C7430473; Manufacturer: Megastar(兆星); Supplier Footprint: SMD,P=1.25mm; JLCPCB Part Class: Extended Part; Datasheet: https://item.szlcsc.com/datasheet/ZX-MX1.25-2PLT/8430342.html; Supplier: LCSC; Pins Structure: 1x2P; Pitch: 1.25mm; Mounting Type: 立贴; Reference Series: PicoBlade(MX 1.25); Number of Pins: 2P; Number of Rows: 1; Number of PINs Per Row: 2; Current Rating: 1A; Contact Material: 黄铜; Contact Plating: 锡; Operating Temperature: -25℃~+85℃; Voltage Rating: 125V; Plastic Material: LCP; Supplementary Features: 辅助焊脚; Color: 米色; Z-Height of the Board: 4.7mm; X-Length of Bottom Edge on Board (Spacing Line): 7.5mm; Y-Width of Bottom Edge on Board: 4.3mm
C3 C9 C12 C13 C15 = CC0402KRX7R9BB104: 容值:100nF;精度:±10%;额定电压:50V;材质(温度系数):X7R;; LCSC Part Name: 100nF ±10% 50V; Supplier Part: C1525; Manufacturer: YAGEO(国巨); Supplier Footprint: 0402; JLCPCB Part Class: 扩展库; Datasheet: https://atta.szlcsc.com/upload/public/pdf/source/20181008/C309510_22F155564471FAF6A489F7D68F34234E.pdf; Supplier: LCSC; Tolerance: ±10%; Voltage Rated: 50V; Temperature Coefficient: X7R
C10 = CL10A106KP8NNNC: 容值:10uF;精度:±10%;额定电压:10V;材质(温度系数):X5R;; LCSC Part Name: 10uF ±10% 10V; Supplier Part: C19702; Manufacturer: SAMSUNG(三星); Supplier Footprint: 0603; JLCPCB Part Class: Basic Part; Datasheet: https://atta.szlcsc.com/upload/public/pdf/source/20160103/1457707703378.pdf; Supplier: LCSC; Tolerance: ±10%; Voltage Rating: 10V; Temperature Coefficient: X5R; Voltage Rated: 10V
C11 C14 = CL05A105KP5NNNC: 容值:1uF;精度:±10%;额定电压:10V;材质(温度系数):X5R;; LCSC Part Name: 1uF ±10% 10V; Supplier Part: C14445; Manufacturer: SAMSUNG(三星); Supplier Footprint: 0402; JLCPCB Part Class: 扩展库; Datasheet: https://atta.szlcsc.com/upload/public/pdf/source/20160103/1457707670698.pdf; Supplier: LCSC; Tolerance: ±10%; Voltage Rated: 10V; Temperature Coefficient: X5R
C16 C17 = 0402CG2R2C500NT: 容值:2.2pF;额定电压:50V;材质(温度系数):C0G;; LCSC Part Name: 2.2pF 50V; Supplier Part: C1559; Manufacturer: FH(风华); Supplier Footprint: 0402; JLCPCB Part Class: 扩展库; Datasheet: https://atta.szlcsc.com/upload/public/pdf/source/20200305/C486355_26A10D38EF8C2A5C37091D0039909270.pdf; Supplier: LCSC; Voltage Rated: 50V; Temperature Coefficient: C0G
C18 C19 = CC0402JRNPO9BN100: 容值:10pF;精度:±5%;额定电压:50V;材质(温度系数):NP0;; LCSC Part Name: 10pF ±5% 50V; Supplier Part: C106199; Manufacturer: YAGEO(国巨); Supplier Footprint: 0402; JLCPCB Part Class: 扩展库; Datasheet: https://atta.szlcsc.com/upload/public/pdf/source/20170518/1495085708228.pdf; Supplier: LCSC; Tolerance: ±5%; Voltage Rated: 50V; Temperature Coefficient: NP0
C78 = 0402CG101J500NT: 容值:100pF;精度:±5%;额定电压:50V;材质(温度系数):C0G;; LCSC Part Name: 100pF ±5% 50V; Supplier Part: C1546; Manufacturer: FH(风华); Supplier Footprint: 0402; JLCPCB Part Class: Basic Part; Datasheet: https://atta.szlcsc.com/upload/public/pdf/source/20200305/C486355_26A10D38EF8C2A5C37091D0039909270.pdf; Supplier: LCSC; Tolerance: ±5%; Voltage Rated: 50V; Temperature Coefficient: C0G
L6 = MLG1005S2N0BT000: 电感值:2nH;精度:-;额定电流:900mA;饱和电流(Isat):-;直流电阻(DCR):70mΩ;; LCSC Part Name: 2nH ±0.1nH; Supplier Part: C76769; Manufacturer: TDK; Supplier Footprint: 0402; JLCPCB Part Class: Extended Part; Datasheet: https://atta.szlcsc.com/upload/public/pdf/source/20160918/1474166917976.pdf; Supplier: LCSC; Rated Current: 900mA; DC Resistance (DCR): 70mΩ; Q @ Freq: 7@100MHz; Frequency - Self Resonant: 7.5GHz
L7 = SDCL1005C24NJTDF: 电感值:24nH;精度:±5%;额定电流:-;饱和电流(Isat):-;直流电阻(DCR):-;; LCSC Part Name: 24nH ±5%; Supplier Part: C74301; Manufacturer: Sunlord(顺络); Supplier Footprint: 0402; JLCPCB Part Class: 扩展库; Datasheet: https://atta.szlcsc.com/upload/public/pdf/source/20210916/2389196E6DC4CA1121B2D3610B126F46.pdf; Supplier: LCSC; Tolerance: ±5%
L8 = LQG15HS2N0S02D: 电感值:2nH;精度:-;额定电流:900mA;饱和电流(Isat):-;直流电阻(DCR):90mΩ;; Supplier Part: C18216; Manufacturer: muRata(村田); Supplier Footprint: 0402; JLCPCB Part Class: 扩展库; Datasheet: https://atta.szlcsc.com/upload/public/pdf/source/20180326/C97997_1F0DD99169B70C50822BB5034156F8BC.pdf; Supplier: LCSC; Rated Current: 900mA; DC Resistance (DCR): 90mΩ; Q @ Freq: 8@100MHz; Frequency - Self Resonant: 6GHz
R14 R57-R59 R67 = RC0402FR-0710KL: 电阻类型:厚膜电阻;阻值:10kΩ;精度:±1%;功率:62.5mW;最大工作电压:50V;温度系数:±100ppm/℃;; LCSC Part Name: 厚膜电阻 10kΩ ±1% 62.5mW; Supplier Part: C25744; Manufacturer: YAGEO(国巨); Supplier Footprint: 0402; JLCPCB Part Class: 扩展库; Datasheet: https://atta.szlcsc.com/upload/public/pdf/source/20170925/C131467_1506321478108990263.pdf; Supplier: LCSC; Type: 厚膜电阻; Tolerance: ±1%; Power(Watts): 62.5mW; Overload Voltage (Max): 50V; Temperature Coefficient: ±100ppm/℃; Operating Temperature Range: -55℃~+155℃
R54 R55 = RT0402BRD07100KL: 电阻类型:薄膜电阻;阻值:100kΩ;精度:±0.1%;功率:62.5mW;最大工作电压:50V;温度系数:±25ppm/℃;; LCSC Part Name: 薄膜电阻 100kΩ ±0.1% 62.5mW; Supplier Part: C852472; Manufacturer: YAGEO(国巨); Supplier Footprint: 0402; JLCPCB Part Class: Extended Part; Datasheet: https://atta.szlcsc.com/upload/public/pdf/source/20210326/C852472_6283D268A9C33EA67274729CC55E28B1.pdf; Supplier: LCSC; Type: 薄膜电阻; Tolerance: ±0.1%; Power(Watts): 62.5mW; Overload Voltage (Max): 50V; Temperature Coefficient: ±25ppm/℃; Operating Temperature Range: -55℃~+155℃
R60 = RC0402FR-0710KL: 电阻类型:厚膜电阻;阻值:10kΩ;精度:±1%;功率:62.5mW;最大工作电压:50V;温度系数:±100ppm/℃;; LCSC Part Name: 厚膜电阻 10kΩ ±1% 62.5mW; Supplier Part: C60490; Manufacturer: YAGEO(国巨); Supplier Footprint: 0402; JLCPCB Part Class: 扩展库; Datasheet: https://atta.szlcsc.com/upload/public/pdf/source/20170925/C131467_1506321478108990263.pdf; Supplier: LCSC; Type: 厚膜电阻; Tolerance: ±1%; Power(Watts): 62.5mW; Overload Voltage (Max): 50V; Temperature Coefficient: ±100ppm/℃; Operating Temperature Range: -55℃~+155℃
SW1-SW3 = K2-1112SA-A4DW-01: 作用力:2.5N;安装方式:卧贴;开关长度:7mm;开关宽度:3.5mm;开关高度:3.5mm;触点电流:50mA;额定电压:12V;工作寿命:10万次;; LCSC Part Name: 3*6侧按键高寿命双弹片; Supplier Part: C961745; Manufacturer: 韩国韩荣; Supplier Footprint: SMD,7x3.5mm; JLCPCB Part Class: Extended Part; Datasheet: https://item.szlcsc.com/datasheet/K2-1112SA-A4DW-01/1041850.html; Supplier: LCSC; Operating Force: 2.5N; Mounting Type: 卧贴; Length: 7mm; Width: 3.5mm; Switch Height: 3.5mm; Contact Current: 50mA; Voltage Rating: 12V; Life: 10万次; Operating Temperature: -25℃~+85℃
U3 = ESP32-S3(R8): 应用领域:蓝牙,WiFi;频率范围:2.412GHz~2.484GHz;数据速率:150Mbps;灵敏度:-98.4dBm;接口:I2C,I2S,SPI,UART,USB;; Supplier Part: C2913194; Manufacturer: ESPRESSIF(乐鑫); Supplier Footprint: QFN-56(7x7); JLCPCB Part Class: 扩展库; Supplier: LCSC; Applications: 蓝牙,WiFi; Operating Voltage: 3.3V; Frequency Range: 2.412GHz~2.484GHz; Data Rate: 150Mbps; Sensitivity: -98.4dBm; Interface: I2C,I2S,SPI,UART,USB; Output Power: 21dBm; Operating Temperature: -40℃~+85℃
U4 = ANT3216LL00R2400A: 天线类型:-;中心频率:2.45GHz;带宽:160MHz;增益:5.05dBi;功率:1W;驻波比:-;; LCSC Part Name: 无线组件陶瓷芯片天线; Supplier Part: C293767; Manufacturer: YAGEO(国巨); Supplier Footprint: 1206; JLCPCB Part Class: Extended Part; Datasheet: https://item.szlcsc.com/datasheet/ANT3216LL00R2400A/278688.html; Supplier: LCSC; Frequency(Center/Band): 2.45GHz; Bandwidth: 160MHz; Peak Gain: 5.05dBi; Impedance: 50Ω; Power: 1W; Operating Temperature: -40℃~+105℃; Length: 3.2mm; Width: 1.6mm; Height: 1.2mm
U18 = W25Q128JVPIQ_C190862: 存储容量:128Mbit;; Supplier Part: C190862; Manufacturer: WINBOND(华邦); Supplier Footprint: WSON-8-EP(5x6); JLCPCB Part Class: 扩展库; Datasheet: https://atta.szlcsc.com/upload/public/pdf/source/20190705/C401662_06B6D416F67ED315879B366F63A3F7C9.pdf; Supplier: LCSC; Memory Size: 128Mbit
U35 = 嘉立创二维码5x5
X1 = S2240000101050JY: 频率:40MHz;频率公差:±10ppm;负载电容:10pF;; LCSC Part Name: 40MHz ±10ppm 内置负载电容:10pF; Supplier Part: C2885592; Manufacturer: JGHC(晶光华); Supplier Footprint: SMD2520-4P; JLCPCB Part Class: 扩展库; Datasheet: https://atta.szlcsc.com/upload/public/pdf/source/20191012/C426971_E72B01839CFBB8D8B48FED2AC1315BE2.pdf; Supplier: LCSC; Crystal Type: 贴片无源晶振; Frequency Tolerance: ±10ppm; Load Capacitance: 10pF; Equivalent Series Resistance (ESR): 50Ω; Operating Temperature: -40℃~+85℃
C63-C69 = CL05A105KA5NQNC: 容值:1uF;精度:±10%;额定电压:25V;材质(温度系数):X5R;; LCSC Part Name: 1uF ±10% 25V; Supplier Part: C52923; Manufacturer: SAMSUNG(三星); Supplier Footprint: 0402; JLCPCB Part Class: 基础库; Datasheet: https://atta.szlcsc.com/upload/public/pdf/source/20160103/1457707735223.pdf; Supplier: LCSC; Tolerance: ±10%; Voltage Rating: 25V; Temperature Coefficient: X5R; Voltage Rated: 25V
D8 D9 = 5819W: 正向压降(Vf):900mV@3A;直流反向耐压(Vr):40V;整流电流:1A;; LCSC Part Name: 电压:40V 电流:1A; Supplier Part: C42401890; Manufacturer: MOT(仁懋); Supplier Footprint: SOD-123; Datasheet: https://item.szlcsc.com/datasheet/5819W/44359216.html; Supplier: LCSC; Voltage - Forward(Vf@If): 900mV@3A; Voltage - DC Reverse(Vr): 40V; Current - Rectified: 1A; Reverse Leakage Current (Ir): 1mA; Operating Junction Temperature Range: -55℃~+150℃; Non-Repetitive Peak Forward Surge Current: 8A
LED2-LED5 = 19-217/GHC-YR1S2/3T: 发光颜色:翠绿;二极管配置:-;主波长:520nm~535nm;色温:-;功率:110mW;安装方式:-;; Supplier Part: C72043; Manufacturer: EVERLIGHT(亿光); Supplier Footprint: 0603; JLCPCB Part Class: Basic Part; Datasheet: https://atta.szlcsc.com/upload/public/pdf/source/20160507/1462613613780.pdf; Supplier: LCSC; Emitted Color: 翠绿; Lens Color: 无色透明; Dominant Wavelength: 520nm~535nm; Peak Wavelength: 518nm; Forward Current: 20mA; Power Dissipation: 110mW; Viewing Angle: 120°; Operating Temperature: -40℃~+85℃
OLED1 = N096-2864KSWEG01-H30: 核心芯片:SSD1306;尺寸(inch):0.96;; LCSC Part Name: 0.96寸 白色 128x64像素分辨率 单色 30PIN; Supplier Part: C2890596; Manufacturer: Wisevision(新智景); JLCPCB Part Class: Extended Part; Datasheet: https://item.szlcsc.com/datasheet/N096-2864KSWEG01-H30/3115544.html; Supplier: LCSC; Controller Type: SSD1306; Size: 0.96
Q2-Q4 Q7 Q8 = AO3401A_C15127: 数量:1个P沟道;漏源电压(Vdss):30V;连续漏极电流(Id):4A;导通电阻(RDS(on)):47mΩ@10V；85mΩ@2.5V；60mΩ@4.5V;耗散功率(Pd):-;阈值电压(Vgs(th)):900mV@250uA;; LCSC Part Name: 1个P沟道 耐压:30V 电流:4A; Supplier Part: C15127; Manufacturer: AOS; Supplier Footprint: SOT-23; JLCPCB Part Class: Basic Part; Datasheet: https://item.szlcsc.com/datasheet/AO3401A/15801.html; Supplier: LCSC; Number: 1个P沟道; Drain to Source Voltage: 30V; Current - Continuous Drain(Id): 4A; RDS(on): 47mΩ@10V；85mΩ@2.5V；60mΩ@4.5V; Gate Threshold Voltage (Vgs(th)): 900mV@250uA; Gate Charge(Qg): 14nC@10V; Input Capacitance(Ciss): 645pF; Reverse Transfer Capacitance (Crss@Vds): 55pF; Output Capacitance(Coss): 80pF
R12 R15 R48 R49 R61-R63 = RC0402FR-07232KL: 电阻类型:厚膜电阻;阻值:232kΩ;精度:±1%;功率:62.5mW;; LCSC Part Name: 232kΩ ±1% 62.5mW; Supplier Part: C309542; Manufacturer: YAGEO(国巨); Supplier Footprint: 0402; JLCPCB Part Class: Extended Part; Datasheet: https://atta.szlcsc.com/upload/public/pdf/source/20181009/C309542_CA3F4488430805647C87B9489F02B718.pdf; Supplier: LCSC; Type: 厚膜电阻; Tolerance: ±1%; Power(Watts): 62.5mW; Temperature Coefficient: ±100ppm/℃; Overload Voltage (Max): 50V; Operating Temperature Range: -55℃~+155℃
R35 R47 R52 R53 R64-R66 = Res_0402: Supplier Footprint: 0402
U25-U27 = TZ-2020S2RGB-5V-I4-MS: 幻彩 小家电 氛围灯 灯带; LCSC Part Name: 贴片灯珠; Supplier Part: C26159668; Manufacturer: TUOZHAN(拓展光电); Supplier Footprint: SMD2020-4P; JLCPCB Part Class: Extended Part; Datasheet: https://item.szlcsc.com/datasheet/TZ-2020S2RGB-5V-I4-MS/27907039.html; Supplier: LCSC
C7 C8 = 0402B221K500NT: 容值:220pF;精度:±10%;额定电压:50V;材质(温度系数):X7R;; LCSC Part Name: 220pF ±10% 50V; Supplier Part: C1530; Manufacturer: FH(风华); Supplier Footprint: 0402; JLCPCB Part Class: 基础库; Datasheet: https://atta.szlcsc.com/upload/public/pdf/source/20200305/C486355_26A10D38EF8C2A5C37091D0039909270.pdf; Supplier: LCSC; Tolerance: ±10%; Voltage Rated: 50V; Temperature Coefficient: X7R
C57 = CL05B104KB54PNC: 容值:100nF;精度:±10%;额定电压:50V;材质(温度系数):X7R;; LCSC Part Name: 100nF ±10% 50V; Supplier Part: C307331; Manufacturer: SAMSUNG(三星); Supplier Footprint: 0402; JLCPCB Part Class: 基础库; Datasheet: https://atta.szlcsc.com/upload/public/pdf/source/20160218/1457707763339.pdf; Supplier: LCSC; Tolerance: ±10%; Voltage Rated: 50V; Temperature Coefficient: X7R
C62 = CAP_0603: Supplier Footprint: 0603
R37 R40 = 0402WGF1003TCE: 电阻类型:厚膜电阻;阻值:100kΩ;精度:±1%;功率:62.5mW;; LCSC Part Name: 100kΩ ±1% 62.5mW; Supplier Part: C25741; Manufacturer: UNI-ROYAL(厚声); Supplier Footprint: 0402; JLCPCB Part Class: 基础库; Datasheet: https://atta.szlcsc.com/upload/public/pdf/source/20200306/C422600_1E6D84923E4A46A82E41ADD87F860B5C.pdf; Supplier: LCSC; Type: 厚膜电阻; Tolerance: ±1%; Power(Watts): 62.5mW; Temperature Coefficient: ±100ppm/℃; Overload Voltage (Max): 50V; Operating Temperature Range: -55℃~+155℃
U7 = ZTS6672S: 钰太科技股份有限公司 MEMS麦克风; Part Code: C9900237692
U12 = MAX98357AETE+T: 功放类型:-;扬声器通道数:单声道;输出功率:3.2Wx2@4Ω;; LCSC Part Name: 微型、低成本、PCM 类 D 级放大器具有 AB 级性能; Supplier Part: C910544; Manufacturer: ADI(亚德诺)/MAXIM(美信); Supplier Footprint: TQFN-16-EP(3x3); JLCPCB Part Class: 扩展库; Datasheet: https://atta.szlcsc.com/upload/public/pdf/source/20210106/C910544_CB6DE4B2CEE254A72E6BDB40E718D281.pdf; Supplier: LCSC; Speaker Channels: 单声道; Output Power: 3.2Wx2@4Ω; Supply Voltage: 2.5V~5.5V; Operating Temperature: -40℃~+85℃
U28 = my_zts6631
C70 C71 = CL05B102KB5NNNC: 容值:1nF;精度:±10%;额定电压:50V;材质(温度系数):X7R;; LCSC Part Name: 1nF ±10% 50V; Supplier Part: C14442; Manufacturer: SAMSUNG(三星); Supplier Footprint: 0402; JLCPCB Part Class: 扩展库; Datasheet: https://atta.szlcsc.com/upload/public/pdf/source/20160103/1457707670498.pdf; Supplier: LCSC; Tolerance: ±10%; Voltage Rated: 50V; Temperature Coefficient: X7R
C72 C73 C79 C80 = CC0603KRX7R9BB104: 容值:100nF;精度:±10%;额定电压:50V;材质(温度系数):X7R;; LCSC Part Name: 100nF ±10% 50V; Supplier Part: C14663; Manufacturer: YAGEO(国巨); Supplier Footprint: 0603; JLCPCB Part Class: Basic Part; Datasheet: https://atta.szlcsc.com/upload/public/pdf/source/20170116/1484561234239.pdf; Supplier: LCSC; Tolerance: ±10%; Voltage Rated: 50V; Temperature Coefficient: X7R
D1 = BAT54C: Supplier Part: C9900013520; Supplier Footprint: SOT-23; Supplier: LCSC
D5 D6 = 1N4148WT_C727112: 二极管配置:独立式;正向压降(Vf):1.25V@150mA;直流反向耐压(Vr):75V;平均整流电流(Io):125mA;反向恢复时间(trr):4ns;; LCSC Part Name: 电压:75V 电流:125mA; Supplier Part: C727112; Manufacturer: TWGMC(台湾迪嘉); Supplier Footprint: SOD-523; JLCPCB Part Class: 扩展库; Datasheet: https://atta.szlcsc.com/upload/public/pdf/source/20200828/C727112_FCA71CBB186A515518FBD85DA79D41CF.pdf; Supplier: LCSC; Diode Configuration: 独立式; Forward Voltage (Vf@If): 1.25V@150mA; Reverse Voltage (Vr): 75V; Average Rectified Current (Io): 125mA; Reverse Leakage Current: 1uA@75V; Reverse Recovery Time (trr): 4ns; Operating Temperature: -65℃~+150℃@(Tj)
L9 L10 = SWPA252012S4R7MT: 电感值:4.7uH;精度:±20%;额定电流:840mA;饱和电流(Isat):1.25A;类型:-;; LCSC Part Name: 4.7uH ±20% 1.25A; Supplier Part: C87640; Manufacturer: Sunlord(顺络); Supplier Footprint: 1008; JLCPCB Part Class: Extended Part; Datasheet: https://item.szlcsc.com/datasheet/SWPA252012S4R7MT/88818.html; Supplier: LCSC; Tolerance: ±20%; Current Rating: 840mA; Current - Saturation(Isat): 1.25A; DC Resistance(DCR): 377mΩ
Q6 = SI2302: 类型:N沟道;漏源电压(Vdss):20V;连续漏极电流(Id):2.6A;功率(Pd):900mW;导通电阻(RDS(on)@Vgs,Id):85mΩ@4.5V,2.6A;阈值电压(Vgs(th)@Id):1.5V@250uA;栅极电荷(Qg@Vgs):-;输入电容(Ciss@Vds):880pF@6V;反向传输电容(Crss@Vds):-;工作温度:+150℃@(Tj);; LCSC Part Name: N沟道 20V 2.6A; Supplier Part: C2841377; Manufacturer: TECH PUBLIC(台舟); Supplier Footprint: SOT-23-3; JLCPCB Part Class: 扩展库; Datasheet: https://atta.szlcsc.com/upload/public/pdf/source/20210810/B45106B571BB908B9120BCB1C1283335.pdf; Supplier: LCSC; Type: N沟道; Drain Source Voltage (Vdss): 20V; Continuous Drain Current (Id): 2.6A; Power Dissipation (Pd): 900mW; Drain Source On Resistance (RDS(on)@Vgs,Id): 85mΩ@4.5V,2.6A; Gate Threshold Voltage (Vgs(th)@Id): 1.5V@250uA; Input Capacitance (Ciss@Vds): 880pF@6V; Operating Temperature: +150℃@(Tj)
U29 = SGM4056-6.8YTDE8G: Supplier Part: C83521; Manufacturer: SGMICRO(圣邦微); Supplier Footprint: TDFN-8L(2x2); JLCPCB Part Class: Extended Part; Datasheet: https://atta.szlcsc.com/upload/public/pdf/source/20180326/C83521_C7D636C09E95ABFFEB45EE46909FC2FA.pdf; Supplier: LCSC
U30 U33 = SGM6036-3.3YUDT6G/TR: 功能类型:降压型;工作电压:1.8V~5.5V;输出电压:3.3V;输出电流:600mA;输出类型:固定;; LCSC Part Name: 输出电流达600mA、功耗低至450nA的超微功耗降压转换器; Supplier Part: C5153601; Manufacturer: SGMICRO(圣邦微); Supplier Footprint: UTDFN-6L(1.5x2); JLCPCB Part Class: Extended Part; Datasheet: https://item.szlcsc.com/datasheet/SGM6036-3.3YUDT6G%252FTR/5780329.html; Supplier: LCSC; Function: 降压型; Voltage - Supply: 1.8V~5.5V; Output Voltage: 3.3V; Output Current: 600mA; Frequency - Switching: 1.4MHz; Operating Temperature: -40℃~+85℃@(TA); Synchronous Rectifier: 是; Number of Outputs: 1; Topology: 降压式; Quiescent Current: 450nA; Switch tube (built-in/external): 内置; Output Type: 固定

## Nets
AGND: C1.2 C24.2 C25.2 C26.2 C27.2 C28.2 C29.2 C35.1 C36.2 C37.2 C40.2 C41.2 C42.2 C82.2 C83.2 MIC1.2(GND) MIC1.3(GND) R4.1 R68.1 U2.5(DGND) U2.10(AGND) U2.21(EP)
GND: C3.1 C7.1 C8.2 C9.1 C10.1 C11.1 C12.1 C13.1 C14.1 C15.1 C16.1 C17.1 C18.1 C19.2 C43.2 C45.2 C47.1 C48.2 C49.1 C50.2 C51.2 C52.1 C53.1 C54.1 C55.1 C56.2 C57.1 C58.2 C59.1 C62.1 C65.1 C66.1 C67.1 C68.1 C69.1 C70.2 C71.2 C72.1 C73.1 C74.1 C78.1 C79.1 C80.1 LED2.1(C) LED3.1(C) LED4.1(C) LED5.1(C) OLED1.1(N.C.(GND)) OLED1.8(VSS) OLED1.10(BS0) OLED1.12(BS2) OLED1.13(CS#) OLED1.16(R/W#) OLED1.17(E/RD#) OLED1.21(D3) OLED1.22(D4) OLED1.23(D5) OLED1.24(D6) OLED1.25(D7) OLED1.29(VLSS) OLED1.30(N.C.(GND)) Q6.2(S) R6.1 R15.2 R35.1 R37.2 R40.2 R41.2 R42.1 R43.2 R45.1 R46.2 R47.1 R48.2 R52.1 R53.1 R55.1 R66.1 R67.1 R68.2 SW1.2 SW1.3 SW1.4 SW2.2 SW2.3 SW2.4 SW3.2 SW3.3 SW3.4 U3.57(GND) U5.7(GND) U12.3(GND) U12.11(GND) U12.15(GND) U12.17(EP) U16.1(Vss) U16.9(EP) U17.1(GND) U17.10(GND) U17.27(GND) U17.34(GND) U17.36(GND) U17.37(GND) U17.40(GND) U17.41(GND) U17.45(GND) U17.46(GND) U17.47(GND) U17.48(GND) U17.70(GND) U17.71(GND) U17.72(GND) U17.73(GND) U17.88(GND) U17.89(GND) U17.90(GND) U17.91(GND) U17.92(GND) U17.93(GND) U17.94(GND) U18.4(GND) U18.9(EP) U19.3 U19.4 U20.1 U20.3 U20.4 U21.2 U21.3 U21.4 U25.3(GND) U26.3(GND) U27.3(GND) U28.3(GND) U28.7(GND) U29.4(EN) U29.5(GND) U29.9(GND) U30.4(GND) U30.7(GND) U33.4(GND) U33.7(GND) U34.3 U34.4 X1.2(GND) X1.4(GND)
VBAT: C71.1 Q2.2(S) Q4.3(D) R49.1 R54.1 U29.8(BAT)
VBAT_IN: Q2.3(D) U20.2
VCC_5V: C70.1 C79.2 D9.1(A) Q3.2(S) Q8.1(G) R64.1 R65.1 R66.2 U29.1(VIN) U33.5(EN) U33.6(VIN)
VCC_5V_IN: Q3.3(D) U21.1
VDD_3V3: C25.1 C26.1 C40.1 C48.1 C50.1 C57.2 C58.1 C59.2 C62.2 C65.2 C66.2 C73.2 C83.1 L9.1 MIC1.4(VDD) OLED1.6(VBAT) OLED1.9(VDD) OLED1.11(BS1) Q7.3(D) R8.2 R38.2 R44.2 R58.1 R59.1 R69.1 U2.3(PVDD) U2.4(DVDD) U2.11(AVDD) U5.6(VCC) U12.7(VDD) U12.8(VDD) U28.6(VDD) U30.3(VOUT)
VDD_RGB: D9.2(C) Q8.2(S) U25.1(VDD) U26.1(VDD) U27.1(VDD)
VDD_SPI: C3.2 U3.29(VDD_SPI) U18.8(VCC)
4G_LED: R63.2 U3.37(SPICLK_P)
4G_RX: U3.16(GPIO11) U17.17(UART0_RXD)
4G_TX: U3.15(GPIO10) U17.18(UART0_TXD)
BLE_LED: R61.2 U3.14(GPIO9)
BOOT: R57.1 SW2.1 U3.5(GPIO0)
CAR_LED: R12.2 U3.13(GPIO8)
CHARGE_3V3: C80.2 D8.1(A) L10.1 Q7.1(G) R53.2 U33.3(VOUT)
CHG: R64.2 U3.18(GPIO13) U29.3(CHG)
ESP_3V3: C9.2 C10.2 C11.2 C12.2 C13.2 C15.2 D8.2(C) L6.1 Q7.2(S) R14.2 R57.2 U3.20(VDD3P3_RTC) U3.46(VDD3P3_CPU) U3.55(VDDA) U3.56(VDDA)
ESP_EN: C14.2 R14.1 U3.4(CHIP_PU)
GPIO1: U3.6(GPIO1) U27.4(DIN)
GPIO2: U3.7(GPIO2)
GPIO3: C78.2 R54.2 R55.2 U3.8(GPIO3)
GPIO4: D1.2(A2) U3.9(GPIO4)
GPIO5: D6.2(A) U3.10(GPIO5)
GPIO6: U3.11(GPIO6)
GPIO7: U3.12(GPIO7)
GPIO12: U3.17(GPIO12)
GPIO14: R65.2 U3.19(GPIO14) U29.2(PPR)
GPIO15: C27.1 U2.2(MCLK) U3.21(XTAL_32K_P)
GPIO16: C28.1 U2.6(SCLK/DMIC_SCL) U3.22(XTAL_32K_N)
GPIO17: U2.7(ASDOUT) U3.23(GPIO17)
GPIO18: C29.1 U2.8(LRCK) U3.24(GPIO18)
GPIO19: U2.9(DSDIN) U3.25(GPIO19)
GPIO20: C82.1 OLED1.19(D1) OLED1.20(D2) R58.2 U2.19(CDATA) U3.26(GPIO20)
GPIO21: C24.1 OLED1.18(D0) R59.2 U2.1(CCLK) U3.27(GPIO21)
GPIO38: U3.43(GPIO38)
GPIO39: U3.44(MTCK)
GPIO40: U3.45(MTDO)
GPIO41: U3.47(MTDI)
GPIO42: SW1.1 U3.48(MTMS)
GPIO45: U3.51(GPIO45)
GPIO46: R67.2 U3.52(GPIO46)
GPIO48: R62.2 U3.36(SPICLK_N)
MIC_DIN: R40.1 U28.1(DATA)
MIC_P: C33.1 C84.2
MIC_SCK: U28.5(BCLK)
MIC_WS: U28.2(LRC)
OUTN: C39.2 C45.1 C46.2
OUTP: C38.2 C43.1 C44.2
PA_CTRL: R6.2 R69.2 U5.1(CTRL)
PA_INL+: R3.1 U5.3(INP)
PA_INL-: R5.1 U5.4(INN)
PA_OUTL+: L11.1 U5.8(VoP)
PA_OUTL-: L12.1 U5.5(VON)
SIM_CLK: U16.6(CLK) U17.13(SIM0_CLK)
SIM_DATA: U16.3(I/O) U17.11(SIM0_DATA)
SIM_DET: R43.1 U17.79(SIM0_DET)
SIM_PWR: C49.2 U16.8(Vdd) U17.14(SIM0_VCC)
SIM_RESET: U16.7(RST) U17.12(SIM0_RST)
SPICLK: U3.33(SPICLK) U18.6(CLK)
SPICS0: U3.32(SPICS0) U18.1(#CS)
SPID: U3.35(SPID) U18.5(DI/IO0)
SPIHD: U3.30(SPIHD) U18.7(#HOLD-OR-#REST/IO3)
SPIQ: U3.34(SPIQ) U18.2(DO/IO1)
SPIWP: U3.31(SPIWP) U18.3(#WP/IO2)
SPK_BCLK: U12.16(BCLK)
SPK_DOUT: U12.1(DIN)
SPK_E+: C7.2 L3.2 U19.2
SPK_E-: C8.1 L2.2 U19.1
SPK_LRCK: U12.14(LRCLK)
U0RX: U3.50(U0RXD)
U0TX: R60.1
VSYS: C72.2 C74.2 L4.2 Q4.2(S) Q8.3(D) U30.5(EN) U30.6(VIN)
XTAL_N: C19.1 U3.53(XTAL_N) X1.3
XTAL_P: C18.2 L7.2 X1.1
Net-(ANT1-1): ANT1.1 U17.35(ANT_MAIN)
Net-(C1-1): C1.1 C34.1
Net-(C16-2): C16.2 L8.2 U4.1
Net-(C17-2): C17.2 L8.1 U3.1(LNA_IN)
Net-(C33-2): C33.2 U2.18(MIC1P/DMIC_SDA)
Net-(C34-2): C34.2 U2.17(MIC1N)
Net-(C35-2): C35.2 U2.16(VMID)
Net-(C36-1): C36.1 U2.15(ADCVREF)
Net-(C37-1): C37.1 U2.14(DACVREF)
Net-(C38-1): C38.1 C41.1 U2.12(OUTP)
Net-(C39-1): C39.1 C42.1 U2.13(OUTN)
Net-(C44-1): C44.1 R3.2
Net-(C46-1): C46.1 R5.2
Net-(C47-2): C47.2 U5.2(Bypass)
Net-(C51-1): C51.1 C52.2 C53.2 C54.2 C55.2 C56.1 L4.1 U17.42(VBAT) U17.43(VBAT)
Net-(C63-1): C63.1 OLED1.3(C2N)
Net-(C63-2): C63.2 OLED1.2(C2P)
Net-(C64-1): C64.1 OLED1.5(C1N)
Net-(C64-2): C64.2 OLED1.4(C1P)
Net-(C67-2): C67.2 OLED1.14(RES#) R8.1
Net-(C68-2): C68.2 OLED1.27(VCOMH)
Net-(C69-2): C69.2 OLED1.28(VCC)
Net-(C84-1): C84.1 MIC1.1(OUT)
Net-(D1-1): D1.1(A1) D5.1(C)
Net-(D1-3): D1.3(K) SW3.1
Net-(D5-2): D5.2(A) Q4.1(G) Q6.3(D) R49.2
Net-(D6-1): D6.1(C) Q6.1(G) R52.2
Net-(L2-1): L2.1 U12.10(OUTN)
Net-(L3-1): L3.1 U12.9(OUTP)
Net-(L6-2): L6.2 U3.2(VDD3P3) U3.3(VDD3P3)
Net-(L7-1): L7.1 U3.54(XTAL_P)
Net-(L9-2): L9.2 U30.2(SW)
Net-(L10-2): L10.2 U33.2(SW)
Net-(L11-2): L11.2 U34.2
Net-(L12-2): L12.2 U34.1
Net-(LED2-2): LED2.2(A) R12.1
Net-(LED3-2): LED3.2(A) R61.1
Net-(LED4-2): LED4.2(A) R62.1
Net-(LED5-2): LED5.2(A) R63.1
Net-(OLED1-15): OLED1.15(D/C#) R44.1 R45.2
Net-(OLED1-26): OLED1.26(IREF) R46.1
Net-(Q2-1): Q2.1(G) R35.2
Net-(Q3-1): Q3.1(G) R47.2
Net-(R4-2): R4.2 U2.20(CE)
Net-(R15-1): R15.1 U29.7(IREF)
Net-(R37-1): R37.1 U12.2(GAIN_SLOT)
Net-(R38-1): R38.1 U12.4(SD_MODE#)
Net-(R41-1): R41.1 U28.4(Selec)
Net-(R42-2): R42.2 U17.7(PWR_ON/OFF)
Net-(R48-1): R48.1 U29.6(IMIN)
Net-(R60-2): R60.2 U3.49(U0TXD)
Net-(U25-4): U25.4(DIN) U26.2(DOU)
Net-(U26-4): U26.4(DIN) U27.2(DOU)

Not connected (* = marked no-connect by the designer): ANT1 2(NC)*; OLED1 7(N.C.); U3 28(SPICS1) 38(GPIO33) 39(GPIO34) 40(GPIO35) 41(GPIO36) 42(GPIO37); U4 2; U7 1(WS) 2(LR) 3(GND) 4(SCK) 5(VDD) 6(SD) 7(CONFIG)*; U12 5(N.C.)* 6(N.C.)* 12(N.C.)* 13(N.C.)*; U16 2(I/O) 4(NULL) 5(NULL); U17 2(RSV) 3(MIC_P) 4(MIC_N) 5(SPK_P) 6(SPK_N) 8(RSV) 9(ADC) 15(RESET) 16(NETLIGHT) 19(UART0_DTR) 20(UART0_RI) 21(UART0_DCD) 22(UART0_CTS) 23(UART0_RTS) 24(VDD_EXT) 25(STATE) 26(RSV) 28(UART1_RXD*) 29(UART1_TXD*) 30(RSV) 31(RSV) 32(RSV) 33(RSV) 38(DBG_RXD) 39(DBG_TXD) 44(RSV) 49(WAKEUP_OUT) 50(RSV) 51(RSV) 52(RSV) 53(RSV) 54(RSV) 55(RSV) 56(RSV) 57(RSV) 58(RSV) 59(USB_DP) 60(USB_DM) 61(USB_VBUS) 62(SIM1_CLK) 63(SIM1_RST) 64(SIM1_DATA) 65(SIM1_VCC) 66(RSV) 67(RSV) 68(RSV) 69(RSV) 74(PWM0) 75(PWM1) 76(GPIO0) 77(GPIO1) 78(RSV) 80(RSV) 81(RSV) 82(BOOT_MODE) 83(RSV) 84(RSV) 85(RSV) 86(GPIO2) 87(GPIO3); U25 2(DOU); U28 8(CONFIG)*; U30 1(IC); U33 1(IC)*

## Notes on the sheets
sheet 1
- For 15dB
- SPK
- MIC
sheet 2
- Key
- ADC
- MCU
- Flash
- OSC
sheet 3
- Addr: 0x18
- Codec & MIC
- 低电平关闭
  高电平打开
- PA & SPK
sheet 4
- RGB
- Addr: 0x3C
- 关机时 打开RGB
- RGB Power
- LCD
- 小车指示灯
- 蓝牙指示灯
- 电源指示灯
- 4G指示灯
- LED
sheet 5
- eSIM
- 电池直供4G
- 4G
sheet 6
- 磁吸充电 5V
- VBAT
- VCC
- 电池电压->3V3
- PPR: 电源存在指示
  CHG: 充电指示
- System DCDC
- 磁吸5V->3V3 专供ESP32
- 0: EN
- Charge
- Start Circuit
- MCU DCDC
- 关机充电时 打开ESP32
- MCU Power Switch
sheet 7
- 3V3
- VSYS
- for all
- SGM6036
- PWR EN
- VBAT
- 4G SIM
- 3.7V BAT
- UART
- GPIO
- GPIO
- GPIO
- I2C
- 5V
- Key
- SGM4056
- 5V Charge
- ESP32S3
- RGB
- I2S&I2C
- ES8311
- SSD1306
- WS2812
- NS4150B
